# Altium project AltiumProject.PrjPcb
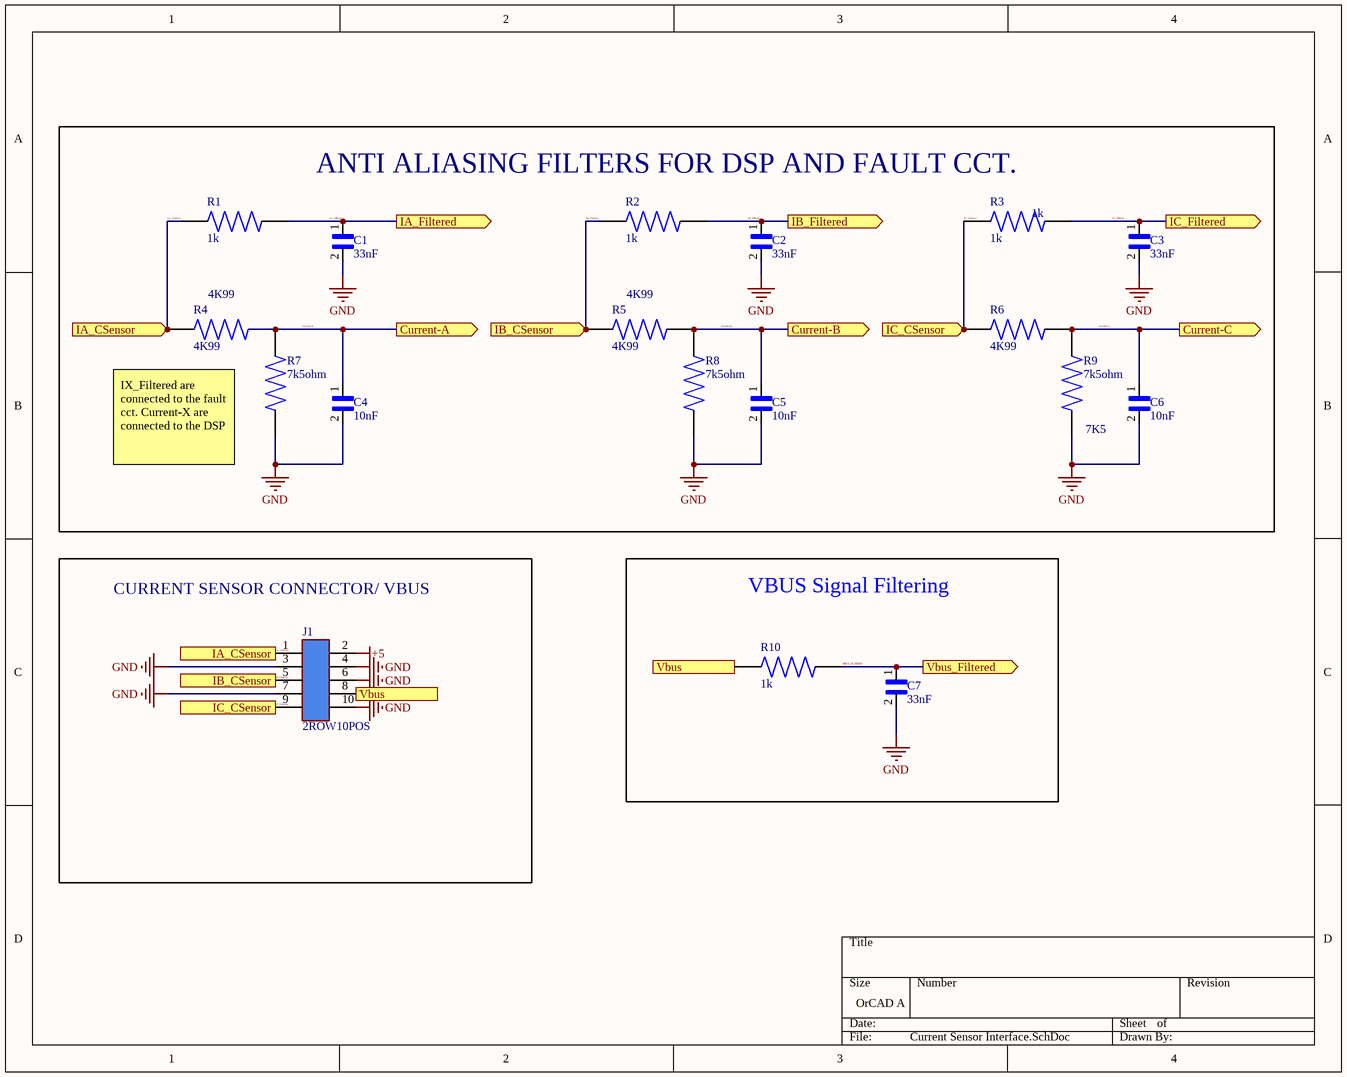
[diagram p0: Current Sensor Interface.SchDoc]
10 sheets, 249 parts. Net scope: flat (ports and power ports of the same name join across sheets).
Board files: Controller_PVC_v2.PcbDoc, Controller_4Layers.PcbDoc, Controller Board.PcbDoc, Control Board 4Layer.PcbDoc
Sheets:
  Current Sensor Interface.SchDoc
  FaultCircuit.SchDoc
  Launchpad.~(23).SchDoc
  PowerSupply.SchDoc
  CAN.SchDoc
  Voltage Sensor Interface.SchDoc
  Temp Sensor Interface.SchDoc
  Resolver.SchDoc
  Gate Driver Interface.SchDoc
  Block Diagram.SchDoc

## Sheet Current Sensor Interface.SchDoc
size OrCAD A

### Parts
C1  33nF  [CAP 0805(2012 metric)]
C2  33nF  [CAP 0805(2012 metric)]
C3  33nF  [CAP 0805(2012 metric)]
C4  10nF  [CAP 0805(2012 metric)]
C5  10nF  [CAP 0805(2012 metric)]
C6  10nF  [CAP 0805(2012 metric)]
C7  33nF  [CAP 0805(2012 metric)]
J1  2ROW10POS  [2ROW10POS]
R1  1k  [RES 0805(2012 metric)]
R2  1k  [RES 0805(2012 metric)]
R3  1k  [RES 0805(2012 metric)]
R4  4K99  [RES 0805(2012 metric)]
R5  4K99  [RES 0805(2012 metric)]
R6  4K99  [RES 0805(2012 metric)]
R7  7k5ohm  [RES 0805(2012 metric)]
R8  7k5ohm  [RES 0805(2012 metric)]
R9  7k5ohm  [RES 0805(2012 metric)]
R10  1k  [RES 0805(2012 metric)]

### Blocks framed on the sheet
ANTI ALIASING FILTERS FOR DSP AND FAULT CCT.: C1-C6 R1-R9
CURRENT SENSOR CONNECTOR/ VBUS: J1
VBUS Signal Filtering: C7 R10

### Ports
Current-A (out), Current-B (out), Current-C (out), IA_CSensor (in), IA_CSensor (out), IA_Filtered (out), IB_CSensor (in), IB_CSensor (out), IB_Filtered (out), IC_CSensor (in), IC_CSensor (out), IC_Filtered (out), Vbus (in), Vbus (out), Vbus_Filtered (out)

### Nets
+5: J1.2
GND: C1.2 C2.2 C3.2 C4.2 C5.2 C6.2 C7.2 J1.3 J1.4 J1.6 J1.7 J1.10 R7.1 R8.1 R9.1
Current-A: C4.1 R4.2 R7.2 ; port Current-A
Current-B: C5.1 R5.2 R8.2 ; port Current-B
Current-C: C6.1 R6.2 R9.2 ; port Current-C
IA_CSensor: J1.1 R1.1 R4.1 ; port IA_CSensor
IA_Filtered: C1.1 R1.2 ; port IA_Filtered
IB_CSensor: J1.5 R2.1 R5.1 ; port IB_CSensor
IB_Filtered: C2.1 R2.2 ; port IB_Filtered
IC_CSensor: J1.9 R3.1 R6.1 ; port IC_CSensor
IC_Filtered: C3.1 R3.2 ; port IC_Filtered
VBUS: J1.8 R10.1 ; port Vbus
VBUS_FILTERED: C7.1 R10.2 ; port Vbus_Filtered

### Notes on the sheet
- (near R3) 1k
- (near R4) 4K99
- (near R5) 4K99
- IX_Filtered are connected to the fault cct. Current-X are connected to the DSP
- (near R9) 7K5

### Library data of the parts
C1-C3 C7 = 33nF: 0.033µF ±10% 100V Ceramic Capacitor X7R 0805 (2012 Metric)
C4-C6 = 10nF: 10000pF ±10% 25V Ceramic Capacitor X7R 0805 (2012 Metric)
R1-R3 R10 = 1k: Resistor 0805 1k ohm 0.1W

## Sheet FaultCircuit.SchDoc
size B; DrawnBy: MYazici
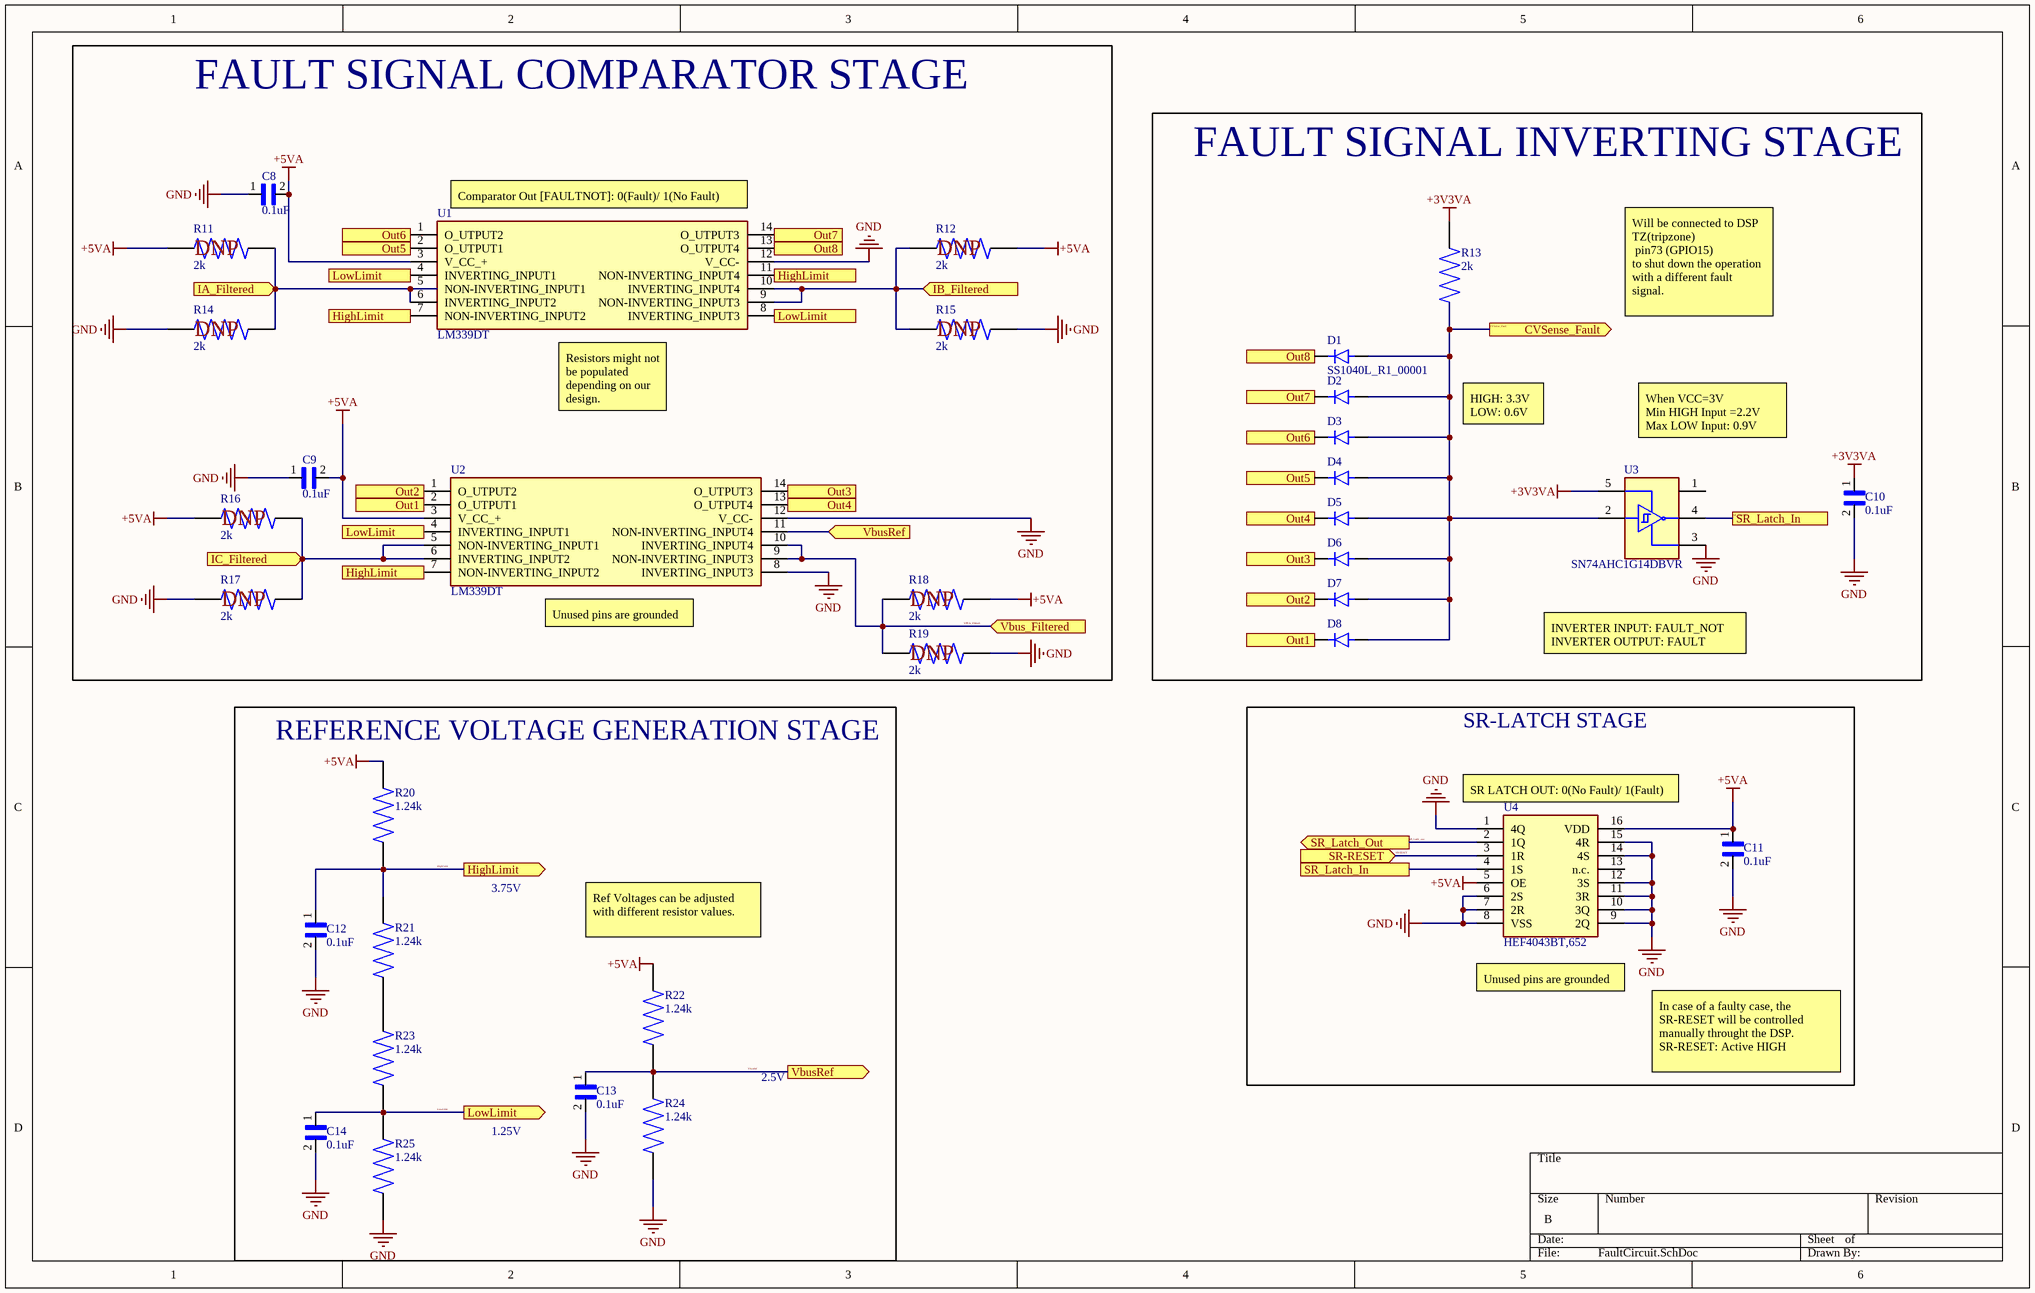
[diagram p1: FaultCircuit.SchDoc]

### Parts
C8  0.1uF  [CAP 0805(2012 metric)]
C9  0.1uF  [CAP 0805(2012 metric)]
C10  0.1uF  [CAP 0805(2012 metric)]
C11  0.1uF  [CAP 0805(2012 metric)]
C12  0.1uF  [CAP 0805(2012 metric)]
C13  0.1uF  [CAP 0805(2012 metric)]
C14  0.1uF  [CAP 0805(2012 metric)]
D1  SS1040L_R1_00001  [SOD123]
D2  SS1040L_R1_00001  [SOD123]  (value not drawn)
D3  SS1040L_R1_00001  [SOD123]  (value not drawn)
D4  SS1040L_R1_00001  [SOD123]  (value not drawn)
D5  SS1040L_R1_00001  [SOD123]  (value not drawn)
D6  SS1040L_R1_00001  [SOD123]  (value not drawn)
D7  SS1040L_R1_00001  [SOD123]  (value not drawn)
D8  SS1040L_R1_00001  [SOD123]  (value not drawn)
R11  2k  [RES 0805(2012 metric)]
R12  2k  [RES 0805(2012 metric)]
R13  2k  [RES 0805(2012 metric)]
R14  2k  [RES 0805(2012 metric)]
R15  2k  [RES 0805(2012 metric)]
R16  2k  [RES 0805(2012 metric)]
R17  2k  [RES 0805(2012 metric)]
R18  2k  [RES 0805(2012 metric)]
R19  2k  [RES 0805(2012 metric)]
R20  1.24k  [RES 0805(2012 metric)]
R21  1.24k  [RES 0805(2012 metric)]
R22  1.24k  [RES 0805(2012 metric)]
R23  1.24k  [RES 0805(2012 metric)]
R24  1.24k  [RES 0805(2012 metric)]
R25  1.24k  [RES 0805(2012 metric)]
U1  LM339DT  [SOIC127P600X175-14N]
U2  LM339DT  [SOIC127P600X175-14N]
U3  SN74AHC1G14DBVR  [SN74AHC1G14DBVR]
U4  HEF4043BT,652  [SOIC127P600X175-16N]

### Blocks framed on the sheet
FAULT SIGNAL COMPARATOR STAGE: C8 C9 R11 R12 R14-R19 U1 U2
FAULT SIGNAL INVERTING STAGE: C10 D1-D8 R13 U3
REFERENCE VOLTAGE GENERATION STAGE: C12-C14 R20-R25
SR-LATCH STAGE: C11 U4

### Ports
CVSense_Fault (out), HighLimit (in), HighLimit (out), IA_Filtered (in), IB_Filtered (in), IC_Filtered (in), LowLimit (in), LowLimit (out), Out1 (in), Out1 (out), Out2 (in), Out2 (out), Out3 (in), Out3 (out), Out4 (in), Out4 (out), Out5 (in), Out5 (out), Out6 (in), Out6 (out), Out7 (in), Out7 (out), Out8 (in), Out8 (out), SR-RESET (in), SR_Latch_In, SR_Latch_Out (out), Vbus_Filtered (in), VbusRef (in), VbusRef (out)

### Nets
+3V3VA: C10.1 R13.2 U3.5(VCC)
+5VA: C8.2 C9.2 C11.1 R11.1 R12.2 R16.1 R18.2 R20.2 R22.2 U1.3(V_CC_+) U2.3(V_CC_+) U4.5(OE) U4.16(VDD)
GND: C8.1 C9.1 C10.2 C11.2 C12.2 C13.2 C14.2 R14.1 R15.2 R17.1 R19.2 R24.1 R25.1 U1.12(V_CC-) U2.8(INVERTING_INPUT3) U2.12(V_CC-) U3.3(GND) U4.1(4Q) U4.6(2S) U4.7(2R) U4.8(VSS) U4.9(2Q) U4.10(3Q) U4.11(3R) U4.12(3S) U4.14(4S) U4.15(4R)
CVSense_Fault: D1.2(Anode) D2.2(Anode) D3.2(Anode) D4.2(Anode) D5.2(Anode) D6.2(Anode) D7.2(Anode) D8.2(Anode) R13.1 U3.2(A) ; port CVSense_Fault
HighLimit: C12.1 R20.1 R21.2 U1.7(NON-INVERTING_INPUT2) U1.11(NON-INVERTING_INPUT4) U2.7(NON-INVERTING_INPUT2) ; port HighLimit
IA_Filtered: R11.2 R14.2 U1.5(NON-INVERTING_INPUT1) U1.6(INVERTING_INPUT2) ; port IA_Filtered
IB_Filtered: R12.1 R15.1 U1.9(NON-INVERTING_INPUT3) U1.10(INVERTING_INPUT4) ; port IB_Filtered
IC_Filtered: R16.2 R17.2 U2.5(NON-INVERTING_INPUT1) U2.6(INVERTING_INPUT2) ; port IC_Filtered
LowLimit: C14.1 R23.1 R25.2 U1.4(INVERTING_INPUT1) U1.8(INVERTING_INPUT3) U2.4(INVERTING_INPUT1) ; port LowLimit
SR-RESET: U4.3(1R) ; port SR-RESET
SR_Latch_In: U3.4(Y) U4.4(1S) ; port SR_Latch_In
SR_Latch_out: U4.2(1Q) ; port SR_Latch_Out
VBUS_FILTERED: R18.1 R19.1 U2.9(NON-INVERTING_INPUT3) U2.10(INVERTING_INPUT4) ; port Vbus_Filtered
VbusRef: C13.1 R22.1 R24.2 U2.11(NON-INVERTING_INPUT4) ; port VbusRef
NetD1_1: D1.1(Cathode) U1.13(O_UTPUT4) ; port Out8
NetD2_1: D2.1(Cathode) U1.14(O_UTPUT3) ; port Out7
NetD3_1: D3.1(Cathode) U1.1(O_UTPUT2) ; port Out6
NetD4_1: D4.1(Cathode) U1.2(O_UTPUT1) ; port Out5
NetD5_1: D5.1(Cathode) U2.13(O_UTPUT4) ; port Out4
NetD6_1: D6.1(Cathode) U2.14(O_UTPUT3) ; port Out3
NetD7_1: D7.1(Cathode) U2.1(O_UTPUT2) ; port Out2
NetD8_1: D8.1(Cathode) U2.2(O_UTPUT1) ; port Out1
NetR21_1: R21.1 R23.2

Not connected (* = marked no-connect by the designer): U3 1(NC); U4 13(n.c.)

### Notes on the sheet
- (near U1) Comparator Out [FAULTNOT]: 0(Fault)/ 1(No Fault)
- (near R11) DNP
- (near R12) DNP
- (near R14) DNP
- (near R15) DNP
- Will be connected to DSP TZ(tripzone)
  pin73 (GPIO15)
  to shut down the operation with a different fault signal.
- (near U1) Resistors might not be populated depending on our design.
- HIGH: 3.3V LOW: 0.6V
- When VCC=3V
  Min HIGH Input =2.2V
  Max LOW Input: 0.9V
- (near R16) DNP
- (near R17) DNP
- (near U2) Unused pins are grounded
- (near R18) DNP
- (near R19) DNP
- INVERTER INPUT: FAULT_NOT
  INVERTER OUTPUT: FAULT
- (near U4) SR LATCH OUT: 0(No Fault)/ 1(Fault)
- 3.75V
- Ref Voltages can be adjusted with different resistor values.
- (near U4) Unused pins are grounded
- 2.5V
- In case of a faulty case, the SR-RESET will be controlled manually throught the DSP.
  SR-RESET: Active HIGH
- 1.25V

### Library data of the parts
C8-C14 = 0.1uF: 0.1µF ±10% 25V Ceramic Capacitor X7R 0805
R11-R19 = 2k 0.1W: 2 kOhms ±1% 0.1W, 1/10W Chip Resistor 0603 (1608 Metric) Moisture Resistant Thick Film
R20-R25 = 1.24k 0805
U1 U2 = LM339DT: Integrated Circuit; Manufacturer_Name: STMicroelectronics; Datasheet Link: http://www.st.com/st-web-ui/static/active/en/resource/technical/document/datasheet/CD00000460.pdf; Height: 1.75mm; Manufacturer_Part_Number: LM339DT; Mouser Part Number: 511-LM339DT; Mouser Price/Stock: https://www.mouser.co.uk/ProductDetail/STMicroelectronics/LM339DT?qs=8q6yV%252BexmWU1LP6UrPvZEQ%3D%3D; Arrow Part Number: LM339DT; Arrow Price/Stock: https://www.arrow.com/en/products/lm339dt/stmicroelectronics; Supplier 1: Avnet; Supplier Part Number 1: LM339DTBR2G
U3 = SN74AHC1G14DBVR: Inverter
U4 = HEF4043BT,652: Integrated Circuit; Manufacturer_Name: Nexperia; Datasheet Link: https://assets.nexperia.com/documents/data-sheet/HEF4043B.pdf; Height: 1.75mm; Manufacturer_Part_Number: HEF4043BT,652; Mouser Part Number: 771-HEF4043BT652; Mouser Price/Stock: https://www.mouser.com/Search/Refine.aspx?Keyword=771-HEF4043BT652; Arrow Part Number: HEF4043BT,652; Arrow Price/Stock: https://www.arrow.com/en/products/hef4043bt652/nexperia

## Sheet Launchpad.~(23).SchDoc
size C
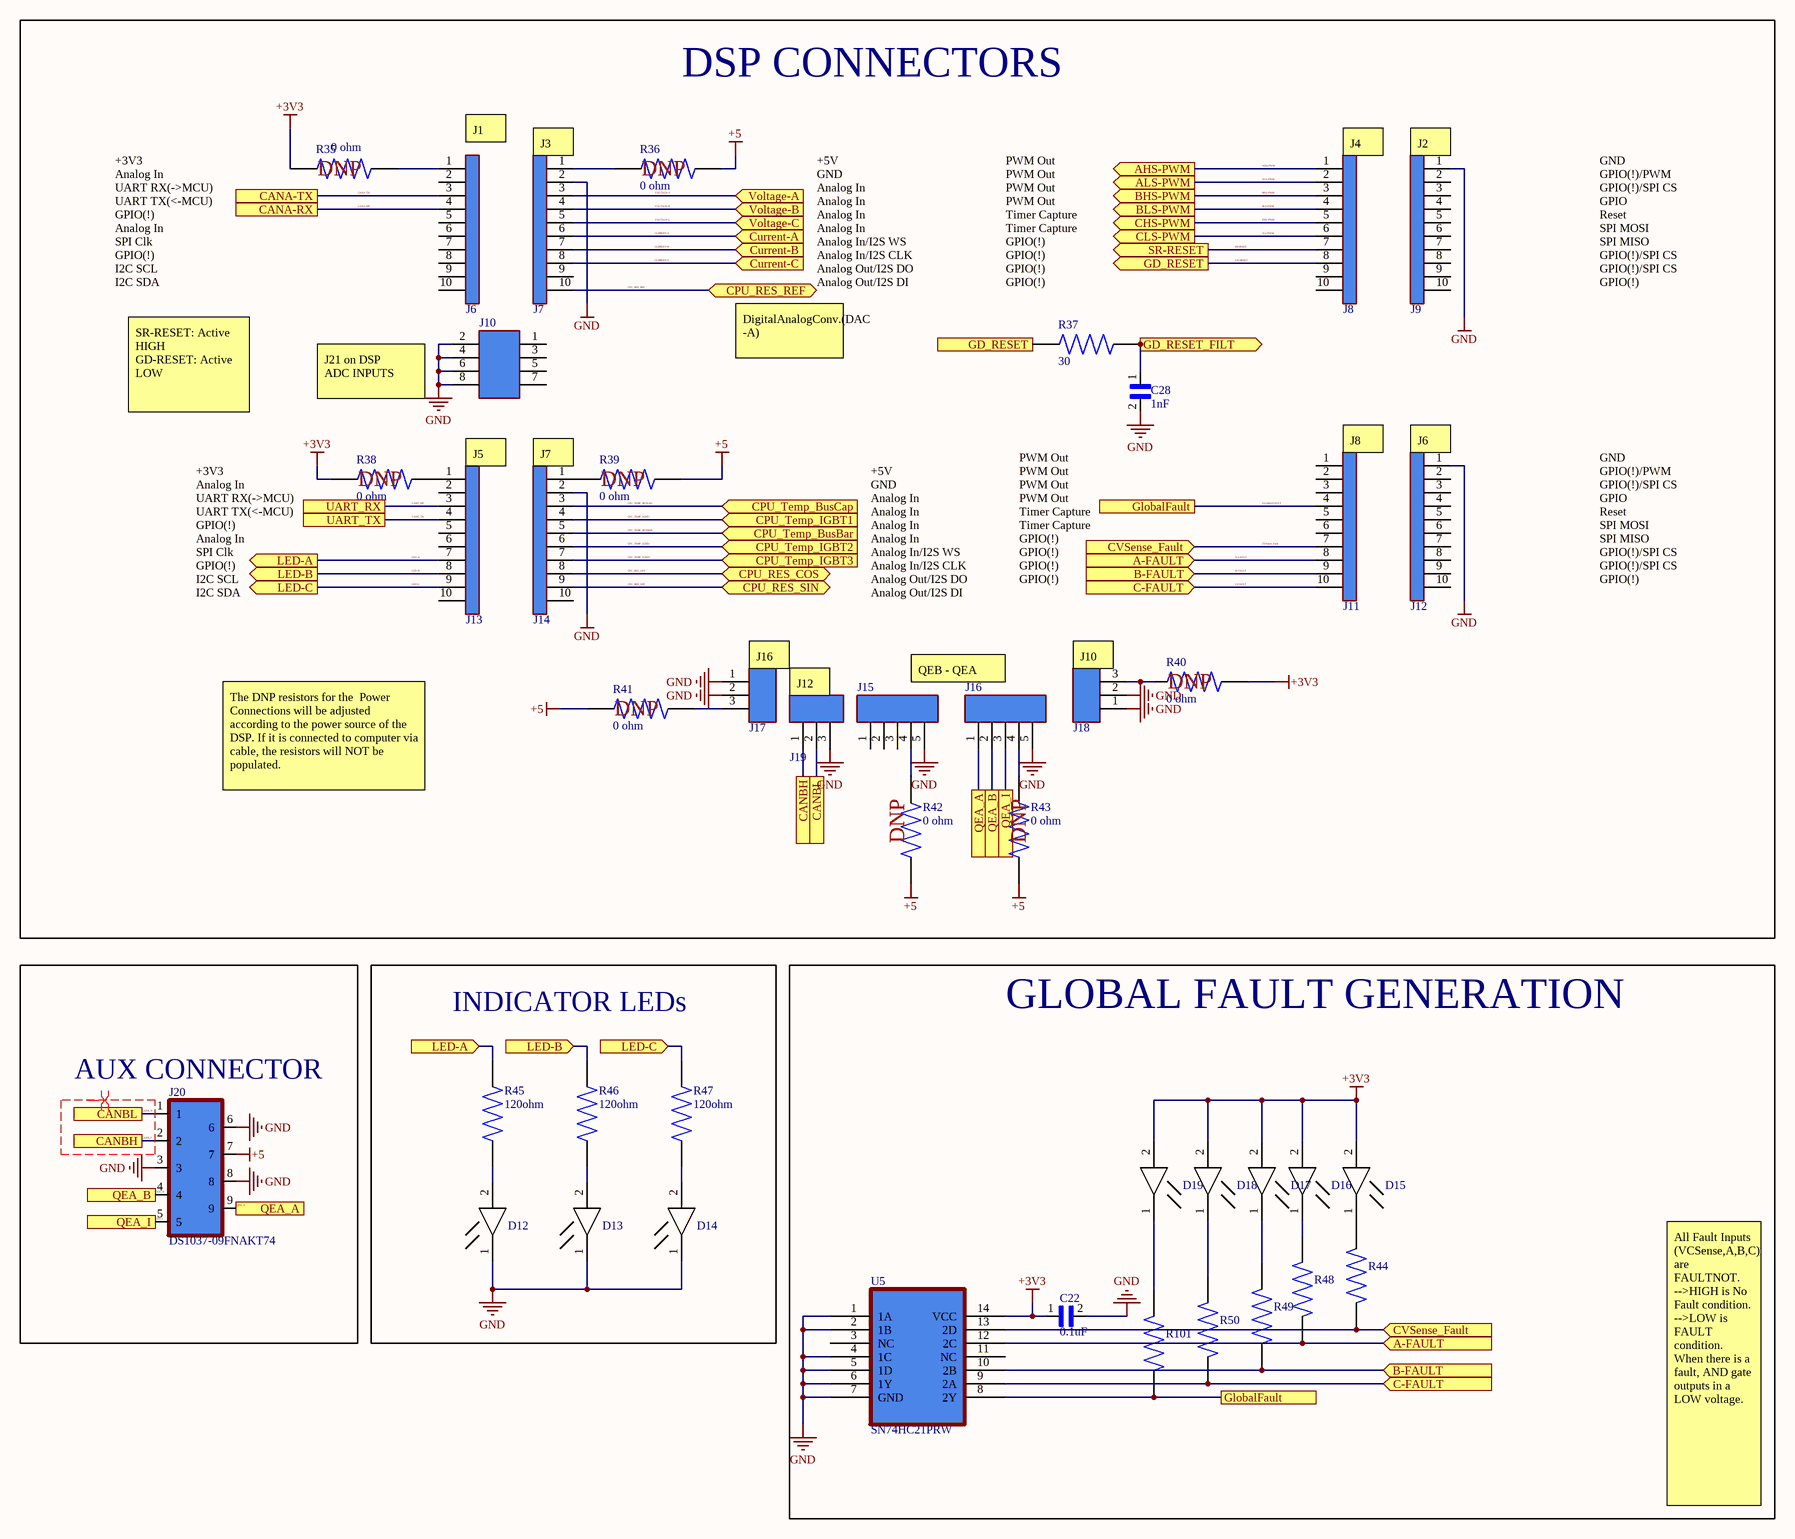
[diagram p2: Launchpad.~(23).SchDoc]

### Parts
(Parts that share a designator on the sheet are numbered #1, #2 ... from top to bottom, then left to right.)
C22  0.1uF  [CAP 0805(2012 metric)]
C28  1nF  [CAP 0805(2012 metric)]
D12  LED 17-21/Y2C-AN1P2/3T  [17-21/Y2C-AN1P2/3T]  (value not drawn)
D13  LED 17-21/Y2C-AN1P2/3T  [17-21/Y2C-AN1P2/3T]  (value not drawn)
D14  LED 17-21/Y2C-AN1P2/3T  [17-21/Y2C-AN1P2/3T]  (value not drawn)
D15  LED 17-21/Y2C-AN1P2/3T  [17-21/Y2C-AN1P2/3T]  (value not drawn)
D16  LED 17-21/Y2C-AN1P2/3T  [17-21/Y2C-AN1P2/3T]  (value not drawn)
D17  LED 17-21/Y2C-AN1P2/3T  [17-21/Y2C-AN1P2/3T]  (value not drawn)
D18  LED 17-21/Y2C-AN1P2/3T  [17-21/Y2C-AN1P2/3T]  (value not drawn)
D19  LED 17-21/Y2C-AN1P2/3T  [17-21/Y2C-AN1P2/3T]  (value not drawn)
J6  1ROW10POS  [1ROW10POS]  (value not drawn)
J7  1ROW10POS  [1ROW10POS]  (value not drawn)
J8  1ROW10POS  [1ROW10POS]  (value not drawn)
J9  1ROW10POS  [1ROW10POS]  (value not drawn)
J10  2ROW8POS  [2ROW8POS]  (value not drawn)
J11  1ROW10POS  [1ROW10POS]  (value not drawn)
J12  1ROW10POS  [1ROW10POS]  (value not drawn)
J13  1ROW10POS  [1ROW10POS]  (value not drawn)
J14  1ROW10POS  [1ROW10POS]  (value not drawn)
J15#1  1ROW5POS  [1ROW5POS]  (value not drawn)
J16  1ROW5POS  [1ROW5POS]  (value not drawn)
J17  1ROW3POS  [1ROW3POS]  (value not drawn)
J18  1ROW3POS  [1ROW3POS]  (value not drawn)
J19  1ROW3POS  [1ROW3POS]  (value not drawn)
J20  DS1037-09FNAKT74  [DSUB CONN 9 POS]
R35  0 ohm  [RES 0805(2012 metric)]
R36  0 ohm  [RES 0805(2012 metric)]
R37  30  [RES 0805(2012 metric)]
R38  0 ohm  [RES 0805(2012 metric)]
R39  0 ohm  [RES 0805(2012 metric)]
R40  0 ohm  [RES 0805(2012 metric)]
R41  0 ohm  [RES 0805(2012 metric)]
R42  0 ohm  [RES 0805(2012 metric)]
R43  0 ohm  [RES 0805(2012 metric)]
R44  1.24k  [RES 0805(2012 metric)]  (value not drawn)
R45  120ohm  [RES 0805(2012 metric)]
R46  120ohm  [RES 0805(2012 metric)]
R47  120ohm  [RES 0805(2012 metric)]
R48  1.24k  [RES 0805(2012 metric)]  (value not drawn)
R49  1.24k  [RES 0805(2012 metric)]  (value not drawn)
R50  1.24k  [RES 0805(2012 metric)]  (value not drawn)
R101  1.24k  [RES 0805(2012 metric)]  (value not drawn)
U5  SN74HC21PRW  [SN74HC21PWR]

### Blocks framed on the sheet
DSP CONNECTORS: C28 J6-J14 J15#1 J16-J19 R35-R43
AUX CONNECTOR: J20
INDICATOR LEDs: D12-D14 R45-R47
GLOBAL FAULT GENERATION: C22 D15-D19 R44 R48-R50 R101 U5

### Ports
A-FAULT (in), AHS-PWM (out), ALS-PWM (out), B-FAULT (in), BHS-PWM (out), BLS-PWM (out), C-FAULT (in), CANA-RX, CANA-TX, CANBH, CANBL, CHS-PWM (out), CLS-PWM (out), CPU_RES_COS (bidir), CPU_RES_REF (bidir), CPU_RES_SIN (bidir), CPU_Temp_BusBar (in), CPU_Temp_BusCap (in), CPU_Temp_IGBT1 (in), CPU_Temp_IGBT2 (in), CPU_Temp_IGBT3 (in), Current-A (in), Current-B (in), Current-C (in), CVSense_Fault (in), GD_RESET (in), GD_RESET (out), GD_RESET_FILT (out), GlobalFault, LED-A (in), LED-A (out), LED-B (in), LED-B (out), LED-C (in), LED-C (out), QEA_A, QEA_B, QEA_I, SR-RESET (out), UART_RX, UART_TX, Voltage-A (in), Voltage-B (in), Voltage-C (in)

### Nets
+3V3: C22.1 D15.2(Anode) D16.2(Anode) D17.2(Anode) D18.2(Anode) D19.2(Anode) R35.1 R38.1 R40.1 U5.14(VCC)
+5: J20.7 R36.2 R39.2 R41.1 R42.1 R43.1
GND: C22.2 C28.2 D12.1(Cathode) D13.1(Cathode) D14.1(Cathode) J7.2 J9.1 J10.2 J10.4 J10.6 J10.8 J12.1 J14.2 J15#1.5 J16.5 J17.1 J17.2 J18.1 J18.2 J19.3 J20.3 J20.6 J20.8 U5.1(1A) U5.2(1B) U5.4(1C) U5.5(1D) U5.6(1Y) U5.7(GND)
A-FAULT: J11.8 R48.1 U5.12(2C) ; port A-FAULT
AHS-PWM: J8.1 ; port AHS-PWM
ALS-PWM: J8.2 ; port ALS-PWM
B-FAULT: J11.9 R49.1 U5.10(2B) ; port B-FAULT
BHS-PWM: J8.3 ; port BHS-PWM
BLS-PWM: J8.4 ; port BLS-PWM
C-FAULT: J11.10 R50.1 U5.9(2A) ; port C-FAULT
CANA-RX: J6.4 ; port CANA-RX
CANA-TX: J6.3 ; port CANA-TX
CANB_N: J19.2 J20.1 ; port CANBL
CANB_P: J19.1 J20.2 ; port CANBH
CHS-PWM: J8.5 ; port CHS-PWM
CLS-PWM: J8.6 ; port CLS-PWM
CPU_RES_COS: J14.8 ; port CPU_RES_COS
CPU_RES_REF: J7.10 ; port CPU_RES_REF
CPU_RES_SIN: J14.9 ; port CPU_RES_SIN
CPU_TEMP_BUSBAR: J14.5 ; port CPU_Temp_BusBar
CPU_TEMP_BUSCAP: J14.3 ; port CPU_Temp_BusCap
CPU_TEMP_IGBT1: J14.4 ; port CPU_Temp_IGBT1
CPU_TEMP_IGBT2: J14.6 ; port CPU_Temp_IGBT2
CPU_TEMP_IGBT3: J14.7 ; port CPU_Temp_IGBT3
Current-A: J7.6 ; port Current-A
Current-B: J7.7 ; port Current-B
Current-C: J7.8 ; port Current-C
CVSense_Fault: J11.7 R44.1 U5.13(2D) ; port CVSense_Fault
GD-RESET: J8.8 R37.1 ; port GD_RESET
GD_RESET_FILT: C28.1 R37.2 ; port GD_RESET_FILT
GLOBALFAULT: J11.4 R101.1 U5.8(2Y) ; port GlobalFault
LED-A: J13.7 R45.2 ; port LED-A
LED-B: J13.8 R46.2 ; port LED-B
LED-C: J13.9 R47.2 ; port LED-C
QEA_A: J16.1 J20.9 ; port QEA_A
QEA_B: J16.2 J20.4 ; port QEA_B
QEA_I: J16.3 J20.5 ; port QEA_I
SR-RESET: J8.7 ; port SR-RESET
UART_RX: J13.3 ; port UART_RX
UART_TX: J13.4 ; port UART_TX
VOLTAGE-A: J7.3 ; port Voltage-A
VOLTAGE-B: J7.4 ; port Voltage-B
VOLTAGE-C: J7.5 ; port Voltage-C
NetD12_2: D12.2(Anode) R45.1
NetD13_2: D13.2(Anode) R46.1
NetD14_2: D14.2(Anode) R47.1
NetD15_1: D15.1(Cathode) R44.2
NetD16_1: D16.1(Cathode) R48.2
NetD17_1: D17.1(Cathode) R49.2
NetD18_1: D18.1(Cathode) R50.2
NetD19_1: D19.1(Cathode) R101.2
NetJ6_1: J6.1 R35.2
NetJ7_1: J7.1 R36.1
NetJ13_1: J13.1 R38.2
NetJ14_1: J14.1 R39.1
NetJ15#1_4: J15#1.4 R42.2
NetJ16_4: J16.4 R43.2
NetJ17_3: J17.3 R41.2
NetJ18_3: J18.3 R40.2

Not connected (* = marked no-connect by the designer): J6 2 5 6 7 8 9 10; J7 9; J8 9 10; J9 2 3 4 5 6 7 8 9 10; J10 1 3 5 7; J11 1 2 3 5 6; J12 2 3 4 5 6 7 8 9 10; J13 2 5 6 10; J14 10; J15#1 1 2 3; U5 3(NC) 11(NC)

### Layout directives
differential pair; differential pair class DIFF90: CANB_N, CANB_P

### Notes on the sheet
- +3V3
- Analog In
- (near R35) DNP
- (near J6) J1
- (near J7) J3
- (near R36) DNP
- +5V
- GND
- PWM Out
- (near J8) J4
- (near J9) J2
- GPIO(!)/PWM
- UART RX(->MCU)
- UART TX(<-MCU)
- GPIO(!)
- SPI Clk
- Analog In/I2S WS
- Timer Capture
- GPIO(!)/SPI CS
- GPIO
- Reset
- SPI MOSI
- SPI MISO
- I2C SCL
- I2C SDA
- Analog In/I2S CLK
- Analog Out/I2S DO
- Analog Out/I2S DI
- DigitalAnalogConv.(DAC -A)
- SR-RESET: Active HIGH
  GD-RESET: Active LOW
- J21 on DSP
  ADC INPUTS
- (near J11) J8
- (near J12) J6
- (near R38) DNP
- (near J13) J5
- (near J14) J7
- (near R39) DNP
- (near R41) DNP
- (near J17) J16
- J12
- QEB - QEA
- (near J18) J10
- (near R40) DNP
- The DNP resistors for the  Power Connections will be adjusted according to the power source of the DSP. If it is connected to computer via cable, the resistors will NOT be populated.
- (near R42) DNP
- (near R43) DNP
- All Fault Inputs (VCSense,A,B,C) are FAULTNOT. -->HIGH is No Fault condition.
  -->LOW is FAULT condition.
  When there is a fault, AND gate outputs in a LOW voltage.

### Library data of the parts
C22 = 0.1uF: as C8 on sheet FaultCircuit
C28 = 0.1uF 25V 0805: 0.1µF ±10% 25V Ceramic Capacitor X7R 0805 (2012Metric)
D12-D19 = LED
J20 = DSBU CONN 9 POS
R35-R43 = 0ohm 0805: 0 ohm 0805 res
R44 R48-R50 R101 = 1.24k 0805
R45-R47 = 120ohm 0805: 120 Ohms ±5% 0.1W, 1/10W Chip Resistor 0805 (2012 Metric) Moisture Resistant Thick Film

## Sheet PowerSupply.SchDoc
size A
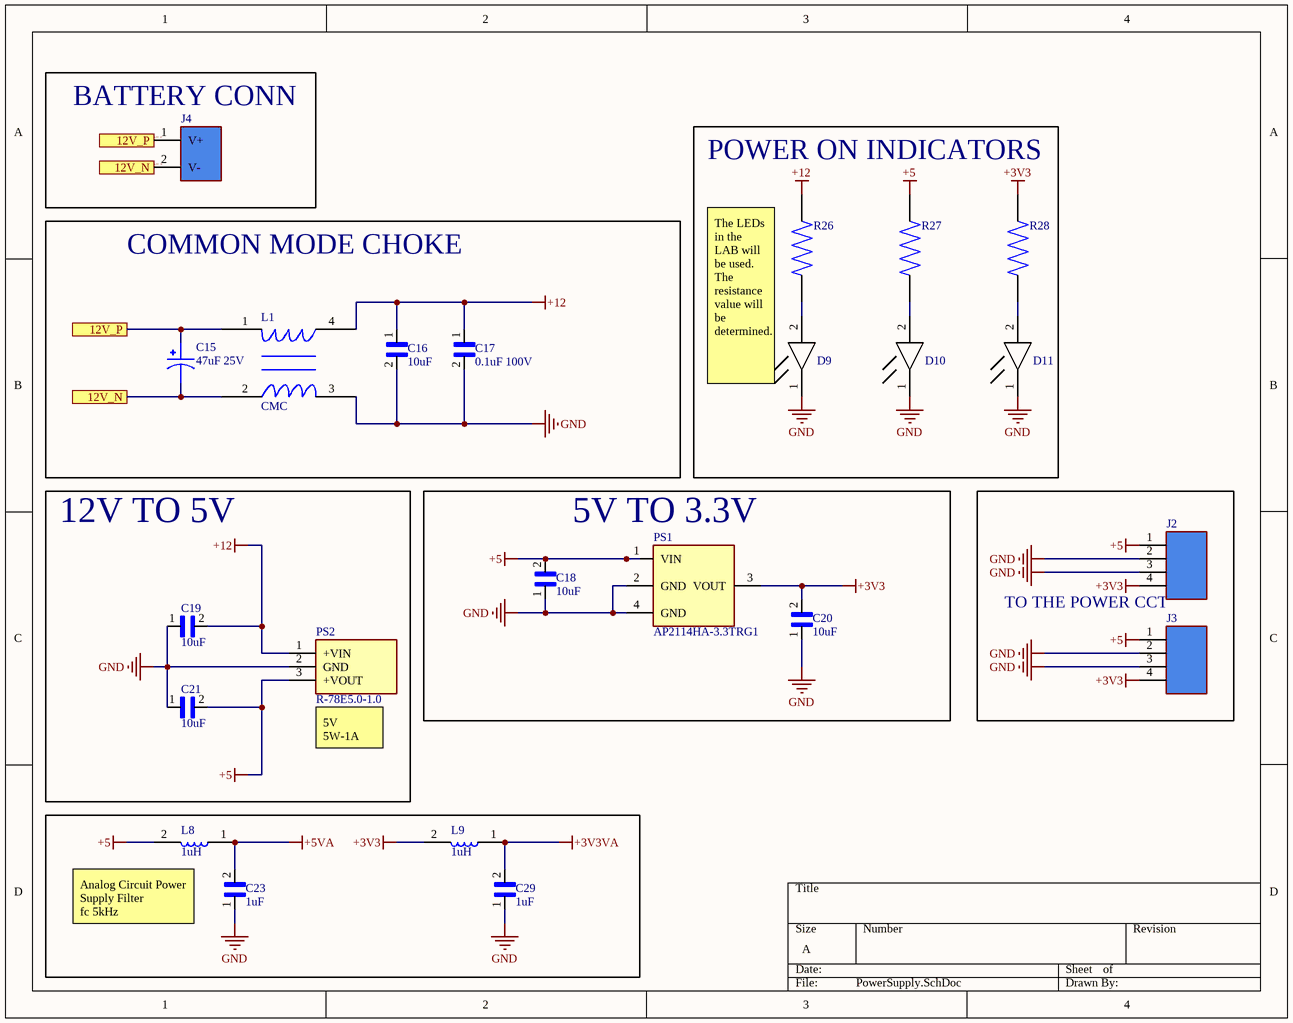
[diagram p3: PowerSupply.SchDoc]

### Parts
(Parts that share a designator on the sheet are numbered #1, #2 ... from top to bottom, then left to right.)
C15  47uF 25V  [EEE-HC1E470XP]
C16  10uF  [CAP 0805(2012 metric)]
C17  0.1uF 100V  [CAP 0805(2012 metric)]
C18  10uF  [CAP 0805(2012 metric)]
C19  10uF  [CAP 0805(2012 metric)]
C20  10uF  [CAP 0805(2012 metric)]
C21  10uF  [CAP 0805(2012 metric)]
C23  1uF  [CAP 0805(2012 metric)]
C29  1uF  [CAP 0805(2012 metric)]
D9  LED 17-21/Y2C-AN1P2/3T  [17-21/Y2C-AN1P2/3T]  (value not drawn)
D10  LED 17-21/Y2C-AN1P2/3T  [17-21/Y2C-AN1P2/3T]  (value not drawn)
D11  LED 17-21/Y2C-AN1P2/3T  [17-21/Y2C-AN1P2/3T]  (value not drawn)
J2  4POS1ROW  [4POS 1 ROW]  (value not drawn)
J3  4POS1ROW  [4POS 1 ROW]  (value not drawn)
J4  2 POS CONN  [2 POS CONN]  (value not drawn)
L1  CMC  [ACM7060-701-2PL-TL01]
L8  1uH  [IND 0805]
L9  1uH  [IND 0805]
PS1  AP2114HA-3.3TRG1  [SOT230P700X180-4N]
PS2  R-78E5.0-1.0  [R78E5010]
R26#1  1.24k  [RES 0805(2012 metric)]  (value not drawn)
R27#1  1.24k  [RES 0805(2012 metric)]  (value not drawn)
R28#1  1.24k  [RES 0805(2012 metric)]  (value not drawn)

### Blocks framed on the sheet
BATTERY CONN: J4
POWER ON INDICATORS: D9-D11 R26#1 R27#1 R28#1
COMMON MODE CHOKE: C15-C17 L1
12V TO 5V: C19 C21 PS2
5V TO 3.3V: C18 C20 PS1
TO THE POWER CCT: J2 J3

### Ports
12V_N, 12V_P

### Nets
+3V3: C20.2 J2.4 J3.4 L9.2 PS1.3(VOUT) R28#1.2
+3V3VA: C29.2 L9.1
+5: C18.2 C21.2 J2.1 J3.1 L8.2 PS1.1(VIN) PS2.3(+VOUT) R27#1.2
+5VA: C23.2 L8.1
+12: C16.1 C17.1 C19.2 L1.4 PS2.1(+VIN) R26#1.2
GND: C16.2 C17.2 C18.1 C19.1 C20.1 C21.1 C23.1 C29.1 D9.1(Cathode) D10.1(Cathode) D11.1(Cathode) J2.2 J2.3 J3.2 J3.3 L1.3 PS1.2(GND) PS1.4(GND) PS2.2(GND)
12V_N: C15.2 J4.2(V-) L1.2 ; port 12V_N
12V_P: C15.1 J4.1(V+) L1.1 ; port 12V_P
NetD9_2: D9.2(Anode) R26#1.1
NetD10_2: D10.2(Anode) R27#1.1
NetD11_2: D11.2(Anode) R28#1.1

### Notes on the sheet
- The LEDs in the LAB will be used.
  The resistance value will be determined.
- (near PS2) 5V
  5W-1A
- Analog Circuit Power Supply Filter
  fc 5kHz

### Library data of the parts
C15 = EEE-HC1E470XP
C16 C18-C21 C23 C29 = 10uF 25 VDC: 10uF %10 tolerance 25VDC 0805
D9-D11 = LED
L1 = ACM7060
L8 L9 = 1uH 0805: 1µH Shielded Multilayer Inductor 1.15A 60mOhm 0805 (2012 Metric)
PS2 = R-78E5.0-1.0: Power Supply; Manufacturer_Name: RECOM Power; Datasheet Link: http://www.recom-power.com/pdf/Innoline/R-78Exx-1.0.pdf; Height: 10.4mm; Manufacturer_Part_Number: R-78E5.0-1.0; Mouser Part Number: 919-R-78E5.0-1.0; Mouser Price/Stock: https://www.mouser.co.uk/ProductDetail/RECOM-Power/R-78E50-10/?qs=T0XSgvH75d4EsZCU9I5HVA%3D%3D; Arrow Part Number: R-78E5.0-1.0; Arrow Price/Stock: https://www.arrow.com/en/products/r-78e5.0-1.0/recom-power
R26#1 R27#1 R28#1 = 1.24k 0805

## Sheet CAN.SchDoc
size A
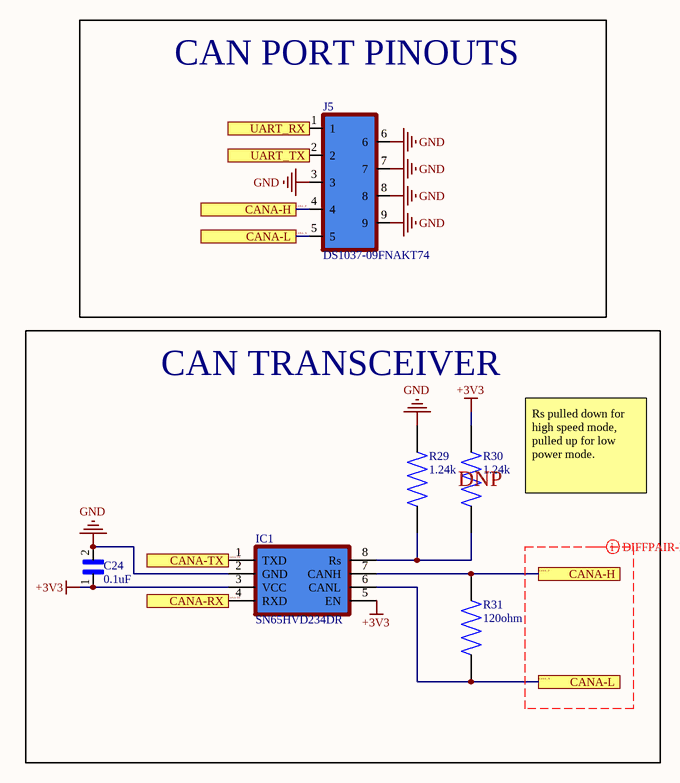
[diagram p4: CAN.SchDoc]

### Parts
C24  0.1uF  [CAP 0805(2012 metric)]
IC1  SN65HVD234DR  [SN65HVD234DR]
J5  DS1037-09FNAKT74  [DSUB CONN 9 POS]
R29  1.24k  [RES 0805(2012 metric)]
R30  1.24k  [RES 0805(2012 metric)]
R31  120ohm  [RES 0805(2012 metric)]

### Blocks framed on the sheet
CAN PORT PINOUTS: J5
CAN TRANSCEIVER: C24 IC1 R29-R31

### Ports
CANA-H, CANA-L, CANA-RX, CANA-TX, UART_RX, UART_TX

### Nets
+3V3: C24.1 IC1.3(VCC) IC1.5(EN) R30.2
GND: C24.2 IC1.2(GND) J5.3 J5.6 J5.7 J5.8 J5.9 R29.2
CANA-RX: IC1.4(RXD) ; port CANA-RX
CANA-TX: IC1.1(TXD) ; port CANA-TX
CANA_N: IC1.6(CANL) J5.5 R31.1 ; port CANA-L
CANA_P: IC1.7(CANH) J5.4 R31.2 ; port CANA-H
UART_RX: J5.1 ; port UART_RX
UART_TX: J5.2 ; port UART_TX
NetIC1_8: IC1.8(Rs) R29.1 R30.1

### Layout directives
differential pair; differential pair class DIFF90: CANA_N, CANA_P

### Notes on the sheet
- (near R30) DNP
- Rs pulled down for high speed mode, pulled up for low power mode.

### Library data of the parts
C24 = 0.1uF 25V 0805: as C28 on sheet Launchpad.~(23)
J5 = DSBU CONN 9 POS
R29 R30 = 1.24k 0805
R31 = 120ohm 0805: as R45 on sheet Launchpad.~(23)

## Sheet Voltage Sensor Interface.SchDoc
size A
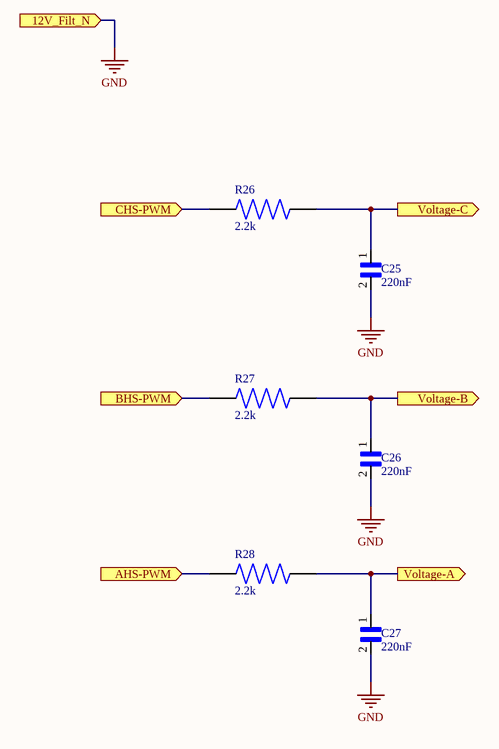
[diagram p5: Voltage Sensor Interface.SchDoc]

### Parts
(Parts that share a designator on the sheet are numbered #1, #2 ... from top to bottom, then left to right.)
C25  220nF  [CAP 0805(2012 metric)]
C26  220nF  [CAP 0805(2012 metric)]
C27  220nF  [CAP 0805(2012 metric)]
R26#2  2.2k  [RES 0805(2012 metric)]
R27#2  2.2k  [RES 0805(2012 metric)]
R28#2  2.2k  [RES 0805(2012 metric)]

### Ports
12V_Filt_N (in), AHS-PWM (in), BHS-PWM (in), CHS-PWM (in), Voltage-A (out), Voltage-B (out), Voltage-C (out)

### Nets
GND: C25.2 C26.2 C27.2 ; port 12V_Filt_N
AHS-PWM: R28#2.1 ; port AHS-PWM
BHS-PWM: R27#2.1 ; port BHS-PWM
CHS-PWM: R26#2.1 ; port CHS-PWM
VOLTAGE-A: C27.1 R28#2.2 ; port Voltage-A
VOLTAGE-B: C26.1 R27#2.2 ; port Voltage-B
VOLTAGE-C: C25.1 R26#2.2 ; port Voltage-C

### Library data of the parts
C25-C27 = 220nF 0805: 220nF 0805 50VDC
R26#2 R27#2 R28#2 = 2.2k 0805

## Sheet Temp Sensor Interface.SchDoc
size A
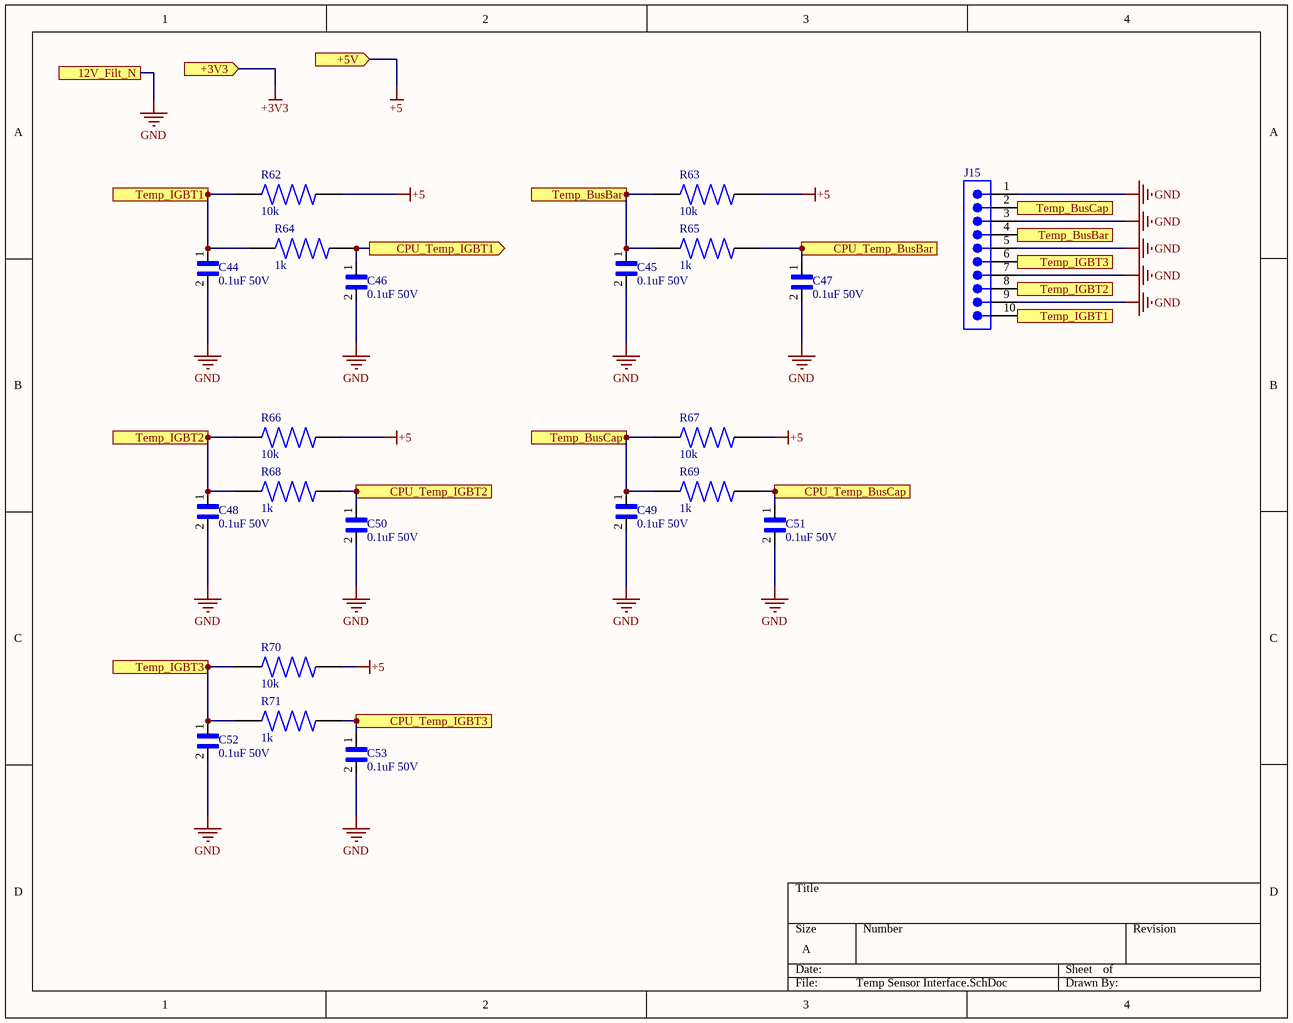
[diagram p6: Temp Sensor Interface.SchDoc]

### Parts
(Parts that share a designator on the sheet are numbered #1, #2 ... from top to bottom, then left to right.)
C44#1  0.1uF 50V  [CAP 0805(2012 metric)]
C45#1  0.1uF 50V  [CAP 0805(2012 metric)]
C46#1  0.1uF 50V  [CAP 0805(2012 metric)]
C47#1  0.1uF 50V  [CAP 0805(2012 metric)]
C48#1  0.1uF 50V  [CAP 0805(2012 metric)]
C49#1  0.1uF 50V  [CAP 0805(2012 metric)]
C50#1  0.1uF 50V  [CAP 0805(2012 metric)]
C51#1  0.1uF 50V  [CAP 0805(2012 metric)]
C52#1  0.1uF 50V  [CAP 0805(2012 metric)]
C53#1  0.1uF 50V  [CAP 0805(2012 metric)]
J15#2  FH2543-10GT10  [PCBComponent_1]  (value not drawn)
R62#1  10k  [RES 0805(2012 metric)]
R63#1  10k  [RES 0805(2012 metric)]
R64#1  1k  [RES 0805(2012 metric)]
R65#1  1k  [RES 0805(2012 metric)]
R66#1  10k  [RES 0805(2012 metric)]
R67#1  10k  [RES 0805(2012 metric)]
R68#1  1k  [RES 0805(2012 metric)]
R69#1  1k  [RES 0805(2012 metric)]
R70#1  10k  [RES 0805(2012 metric)]
R71#1  1k  [RES 0805(2012 metric)]

### Ports
12V_Filt_N, +3V3 (in), +5V (in), CPU_Temp_BusBar (out), CPU_Temp_BusCap (out), CPU_Temp_IGBT1 (out), CPU_Temp_IGBT2 (out), CPU_Temp_IGBT3 (out), Temp_BusBar (in), Temp_BusBar (out), Temp_BusCap (in), Temp_BusCap (out), Temp_IGBT1 (in), Temp_IGBT1 (out), Temp_IGBT2 (in), Temp_IGBT2 (out), Temp_IGBT3 (in), Temp_IGBT3 (out)

### Nets
+5: R62#1.2 R63#1.2 R66#1.2 R67#1.2 R70#1.2 ; port +5V
GND: C44#1.2 C45#1.2 C46#1.2 C47#1.2 C48#1.2 C49#1.2 C50#1.2 C51#1.2 C52#1.2 C53#1.2 J15#2.1 J15#2.3 J15#2.5 J15#2.7 J15#2.9 ; port 12V_Filt_N
CPU_TEMP_BUSBAR: C47#1.1 R65#1.2 ; port CPU_Temp_BusBar
CPU_TEMP_BUSCAP: C51#1.1 R69#1.2 ; port CPU_Temp_BusCap
CPU_TEMP_IGBT1: C46#1.1 R64#1.2 ; port CPU_Temp_IGBT1
CPU_TEMP_IGBT2: C50#1.1 R68#1.2 ; port CPU_Temp_IGBT2
CPU_TEMP_IGBT3: C53#1.1 R71#1.2 ; port CPU_Temp_IGBT3
NetC44#1_1: C44#1.1 J15#2.10 R62#1.1 R64#1.1 ; port Temp_IGBT1
NetC45#1_1: C45#1.1 J15#2.4 R63#1.1 R65#1.1 ; port Temp_BusBar
NetC48#1_1: C48#1.1 J15#2.8 R66#1.1 R68#1.1 ; port Temp_IGBT2
NetC49#1_1: C49#1.1 J15#2.2 R67#1.1 R69#1.1 ; port Temp_BusCap
NetC52#1_1: C52#1.1 J15#2.6 R70#1.1 R71#1.1 ; port Temp_IGBT3

### Library data of the parts
C44#1 C45#1 C46#1 C47#1 C48#1 C49#1 C50#1 C51#1 C52#1 C53#1 = 0.1uF 50V: 0.1uF 50VDC 0805
J15#2 = 1009002200006: Connector,Pin Socket,Straight,Female,1x10Pin,2.54MM pitch,8.5,3.2,Gold Flash 1u,black,DIP; Manufacturer: MTCONN; Value: 2.54mm 1x10; Embest PN: 1009002200006; Part Type: Pin Socket; Manufacturer Part Number: FH2543-10GT10
R62#1 R63#1 R66#1 R67#1 R70#1 = 10k 0.1W 0805
R64#1 R65#1 R68#1 R69#1 R71#1 = 1k: Resistor 0805 1k ohm 0.1W

## Sheet Resolver.SchDoc
size C
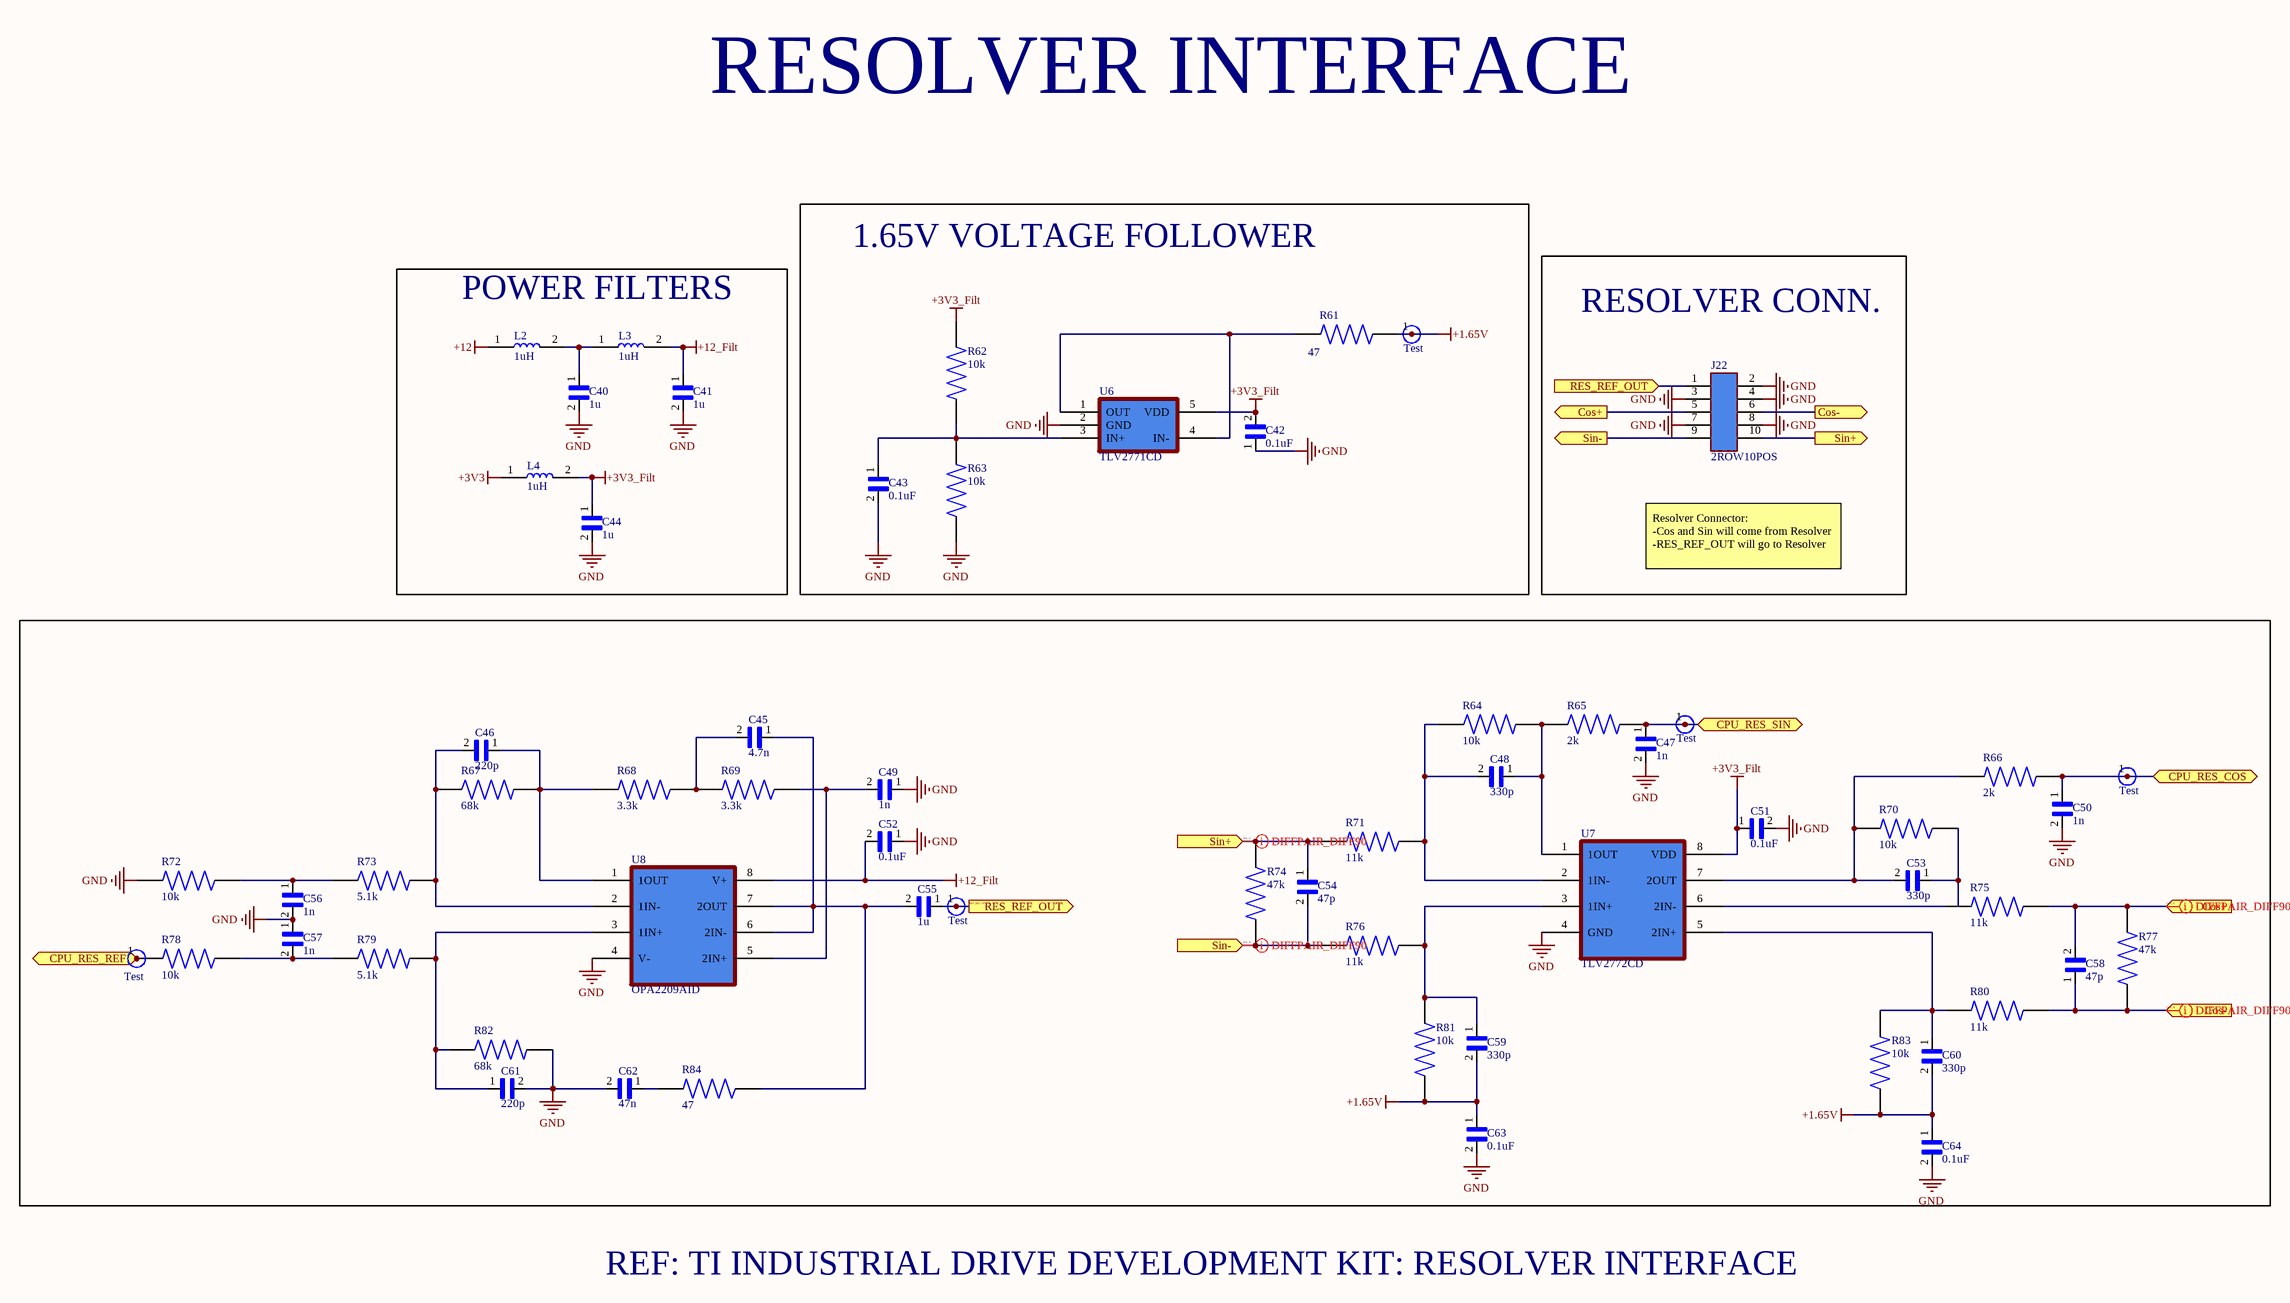
[diagram p7: Resolver.SchDoc]

### Parts
(Parts that share a designator on the sheet are numbered #1, #2 ... from top to bottom, then left to right.)
5  Test  [TestPoint]
6  Test  [TestPoint]
7  Test  [TestPoint]
8  Test  [TestPoint]
9  Test  [TestPoint]
C40  1u  [CAP 0805(2012 metric)]
C41  1u  [CAP 0805(2012 metric)]
C42  0.1uF  [CAP 0805(2012 metric)]
C43  0.1uF  [CAP 0805(2012 metric)]
C44#2  1u  [CAP 0805(2012 metric)]
C45#2  4.7n  [CAP 0805(2012 metric)]
C46#2  220p  [CAP 0805(2012 metric)]
C47#2  1n  [CAP 0805(2012 metric)]
C48#2  330p  [CAP 0805(2012 metric)]
C49#2  1n  [CAP 0805(2012 metric)]
C50#2  1n  [CAP 0805(2012 metric)]
C51#2  0.1uF  [CAP 0805(2012 metric)]
C52#2  0.1uF  [CAP 0805(2012 metric)]
C53#2  330p  [CAP 0805(2012 metric)]
C54  47p  [CAP 0805(2012 metric)]
C55  1u  [CAP 0805(2012 metric)]
C56  1n  [CAP 0805(2012 metric)]
C57  1n  [CAP 0805(2012 metric)]
C58  47p  [CAP 0805(2012 metric)]
C59  330p  [CAP 0805(2012 metric)]
C60  330p  [CAP 0805(2012 metric)]
C61  220p  [CAP 0805(2012 metric)]
C62  47n  [CAP 0805(2012 metric)]
C63  0.1uF  [CAP 0805(2012 metric)]
C64  0.1uF  [CAP 0805(2012 metric)]
J22  2ROW10POS  [2ROW10POS]
L2  1uH  [IND 0805]
L3  1uH  [IND 0805]
L4  1uH  [IND 0805]
R61  47  [RES 0805(2012 metric)]
R62#2  10k  [RES 0805(2012 metric)]
R63#2  10k  [RES 0805(2012 metric)]
R64#2  10k  [RES 0805(2012 metric)]
R65#2  2k  [RES 0805(2012 metric)]
R66#2  2k  [RES 0805(2012 metric)]
R67#2  68k  [RES 0805(2012 metric)]
R68#2  3.3k  [RES 0805(2012 metric)]
R69#2  3.3k  [RES 0805(2012 metric)]
R70#2  10k  [RES 0805(2012 metric)]
R71#2  11k  [RES 0805(2012 metric)]
R72  10k  [RES 0805(2012 metric)]
R73  5.1k  [RES 0805(2012 metric)]
R74  47k  [RES 0805(2012 metric)]
R75  11k  [RES 0805(2012 metric)]
R76  11k  [RES 0805(2012 metric)]
R77  47k  [RES 0805(2012 metric)]
R78  10k  [RES 0805(2012 metric)]
R79  5.1k  [RES 0805(2012 metric)]
R80  11k  [RES 0805(2012 metric)]
R81  10k  [RES 0805(2012 metric)]
R82  68k  [RES 0805(2012 metric)]
R83  10k  [RES 0805(2012 metric)]
R84  47  [RES 0805(2012 metric)]
U6  TLV2771CD  [TLV2771CD]
U7  TLV2772CD  [TLV2772CD]
U8  OPA2209AID  [OPA2209AID]

### Blocks framed on the sheet
1.65V VOLTAGE FOLLOWER: 5 C42 C43 R61 R62#2 R63#2 U6
POWER FILTERS: C40 C41 C44#2 L2-L4
RESOLVER CONN.: J22

### Ports
Cos+ (in), Cos+ (out), Cos- (in), Cos- (out), CPU_RES_COS (bidir), CPU_RES_REF (bidir), CPU_RES_SIN (bidir), RES_REF_OUT (in), RES_REF_OUT (out), Sin+ (in), Sin+ (out), Sin- (in), Sin- (out)

### Nets
+1.65V: 5.1 C59.2 C60.2 C63.1 C64.1 R61.2 R81.1 R83.1
+3V3: L4.1
+3V3_Filt: C42.2 C44#2.1 C51#2.1 L4.2 R62#2.2 U6.5(VDD) U7.8(VDD)
+12: L2.1
+12_Filt: C41.1 C52#2.2 L3.2 U8.8(V+)
GND: C40.2 C41.2 C42.1 C43.2 C44#2.2 C47#2.2 C49#2.1 C50#2.2 C51#2.2 C52#2.1 C56.2 C57.1 C61.2 C62.2 C63.2 C64.2 J22.2 J22.3 J22.4 J22.7 J22.8 R63#2.1 R72.1 R82.1 U6.2(GND) U7.4(GND) U8.4(V-)
COS_N: C58.1 J22.6 R77.2 R80.2 ; port Cos-
COS_P: C58.2 J22.5 R75.2 R77.1 ; port Cos+
CPU_RES_COS: 7.1 C50#2.1 R66#2.2 ; port CPU_RES_COS
CPU_RES_REF: 9.1 R78.1 ; port CPU_RES_REF
CPU_RES_SIN: 6.1 C47#2.1 R65#2.2 ; port CPU_RES_SIN
RES_REF_OUT: 8.1 C55.1 J22.1 ; port RES_REF_OUT
SIN_N: C54.2 J22.9 R74.1 R76.1 ; port Sin-
SIN_P: C54.1 J22.10 R71#2.1 R74.2 ; port Sin+
NetC40_1: C40.1 L2.2 L3.1
NetC43_1: C43.1 R62#2.1 R63#2.2 U6.3(IN+)
NetC45#2_1: C45#2.1 C55.2 R84.2 U8.6(2IN-) U8.7(2OUT)
NetC45#2_2: C45#2.2 R68#2.2 R69#2.1
NetC46#2_1: C46#2.1 R67#2.2 R68#2.1 U8.1(1OUT)
NetC46#2_2: C46#2.2 R67#2.1 R73.2 U8.2(1IN-)
NetC48#2_1: C48#2.1 R64#2.2 R65#2.1 U7.1(1OUT)
NetC48#2_2: C48#2.2 R64#2.1 R71#2.2 U7.2(1IN-)
NetC49#2_2: C49#2.2 R69#2.2 U8.5(2IN+)
NetC53#2_1: C53#2.1 R70#2.2
NetC53#2_2: C53#2.2 R66#2.1 R70#2.1 U7.7(2OUT)
NetC56_1: C56.1 R72.2 R73.1
NetC57_2: C57.2 R78.2 R79.1
NetC59_1: C59.1 R76.2 R81.2 U7.3(1IN+)
NetC60_1: C60.1 R80.1 R83.2 U7.5(2IN+)
NetC61_1: C61.1 R79.2 R82.2 U8.3(1IN+)
NetC62_1: C62.1 R84.1
NetR61_1: R61.1 U6.1(OUT) U6.4(IN-)
NetR75_1: R75.1 U7.6(2IN-)

### Layout directives
differential pair; differential pair class DIFF90: COS_N, COS_P, SIN_N, SIN_P

### Notes on the sheet
- RESOLVER INTERFACE
- Resolver Connector:
  -Cos and Sin will come from Resolver
  -RES_REF_OUT will go to Resolver
- REF: TI INDUSTRIAL DRIVE DEVELOPMENT KIT: RESOLVER INTERFACE

### Library data of the parts
5-9 = TestPoint
C40 C41 C44#2 C55 = 1u 0805
C42 C43 C51#2 C63 C64 = 0.1uF: as C8 on sheet FaultCircuit
C45#2 = 4.7n 0805
C46#2 C61 = 220p 0805
C47#2 C49#2 C50#2 C56 C57 = 1n 0805
C48#2 C53#2 C59 C60 = 330p 0805
C52#2 = 0.1uF 25V 0805: as C28 on sheet Launchpad.~(23)
C54 C58 = 47p 0805
C62 = 47n 0805
L2-L4 = 1uH 0805: as L8 on sheet PowerSupply
R61 R84 = 100ohm 0.1W: 100 Ohms ±1% 0.1W, 1/10W Chip Resistor 0805(2012 Metric) Moisture Resistant Thick Film
R62#2 R63#2 R64#2 R70#2 R72 R78 R81 R83 = 10k 0.1W 0805
R65#2 R66#2 = 2k 0805
R67#2 R82 = 68k 0805
R68#2 R69#2 = 3.3k 0805
R71#2 R75 R76 R80 = 11k 0805
R73 R79 = 5.1k 0805
R74 R77 = 47k 0805
U6 = TLV2771CD: TLV2771IDBVR
U7 = TLV2772CD: tlv2772cdR

## Sheet Gate Driver Interface.SchDoc
size B
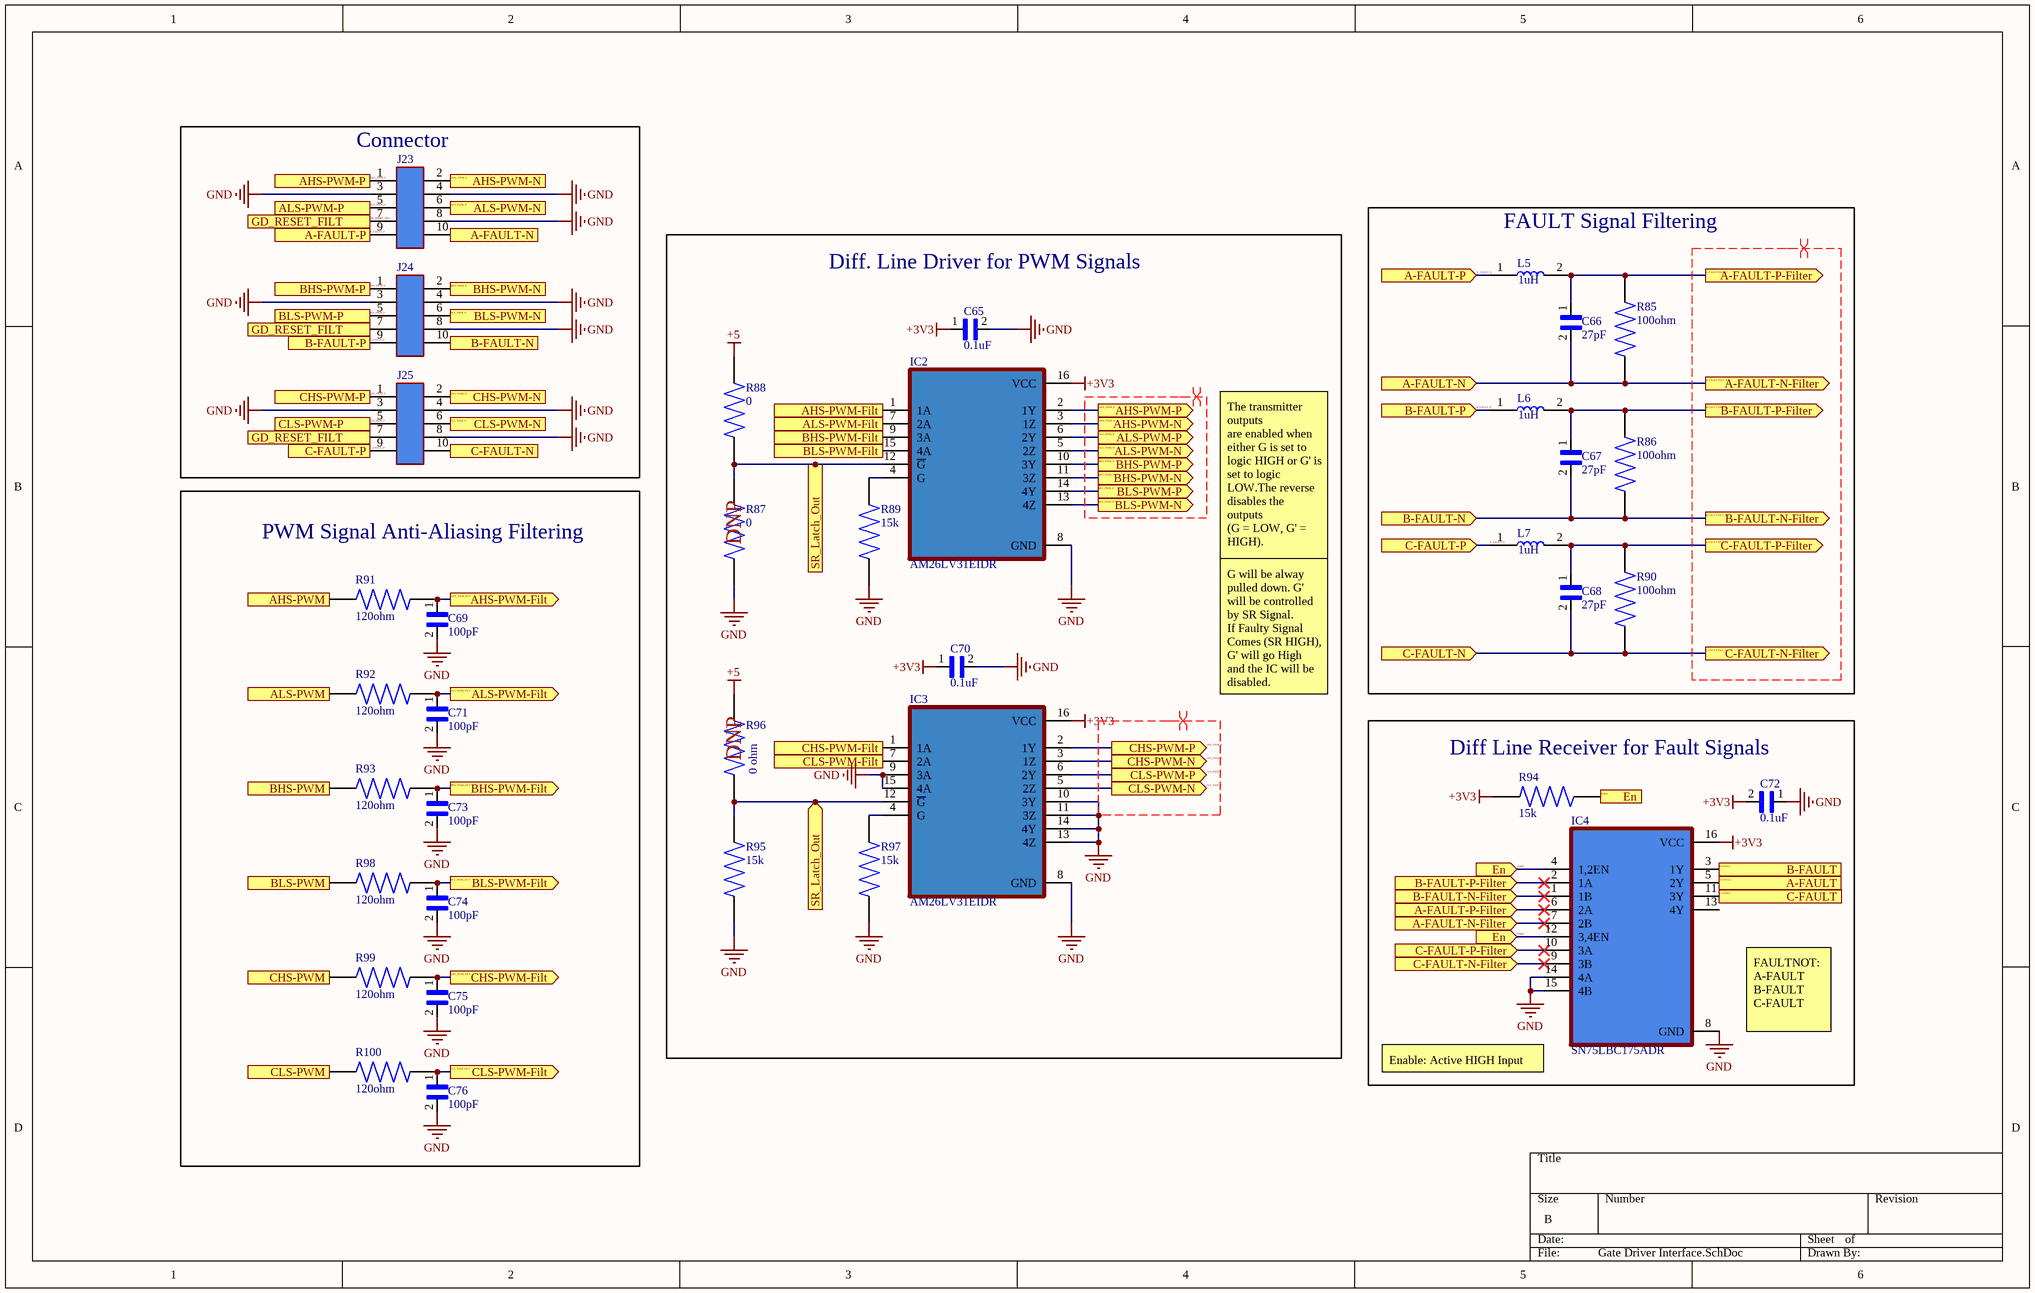
[diagram p8: Gate Driver Interface.SchDoc]

### Parts
C65  0.1uF  [CAP 0805(2012 metric)]
C66  27pF  [CAP 0805(2012 metric)]
C67  27pF  [CAP 0805(2012 metric)]
C68  27pF  [CAP 0805(2012 metric)]
C69  100pF  [CAP 0805(2012 metric)]
C70  0.1uF  [CAP 0805(2012 metric)]
C71  100pF  [CAP 0805(2012 metric)]
C72  0.1uF  [CAP 0805(2012 metric)]
C73  100pF  [CAP 0805(2012 metric)]
C74  100pF  [CAP 0805(2012 metric)]
C75  100pF  [CAP 0805(2012 metric)]
C76  100pF  [CAP 0805(2012 metric)]
IC2  AM26LV31EIDR  [SOIC127P600X175-16N]
IC3  AM26LV31EIDR  [SOIC127P600X175-16N]
IC4  SN75LBC175ADR  [SN75LBC175ADR]
J23  2ROW10POS  [2ROW10POS]  (value not drawn)
J24  2ROW10POS  [2ROW10POS]  (value not drawn)
J25  2ROW10POS  [2ROW10POS]  (value not drawn)
L5  1uH  [IND 0805]
L6  1uH  [IND 0805]
L7  1uH  [IND 0805]
R85  100ohm  [RES 0805(2012 metric)]
R86  100ohm  [RES 0805(2012 metric)]
R87  0  [RES 0805(2012 metric)]
R88  0  [RES 0805(2012 metric)]
R89  15k  [RES 0805(2012 metric)]
R90  100ohm  [RES 0805(2012 metric)]
R91  120ohm  [RES 0805(2012 metric)]
R92  120ohm  [RES 0805(2012 metric)]
R93  120ohm  [RES 0805(2012 metric)]
R94  15k  [RES 0805(2012 metric)]
R95  15k  [RES 0805(2012 metric)]
R96  0 ohm  [RES 0805(2012 metric)]
R97  15k  [RES 0805(2012 metric)]
R98  120ohm  [RES 0805(2012 metric)]
R99  120ohm  [RES 0805(2012 metric)]
R100  120ohm  [RES 0805(2012 metric)]

### Blocks framed on the sheet
Connector: J23-J25
FAULT Signal Filtering: C66-C68 L5-L7 R85 R86 R90
PWM Signal Anti-Aliasing Filtering: C69 C71 C73-C76 R91-R93 R98-R100
Diff Line Receiver for Fault Signals: C72 IC4 R94

### Ports
A-FAULT (out), A-FAULT-N (in), A-FAULT-N (out), A-FAULT-N-Filter (in), A-FAULT-N-Filter (out), A-FAULT-P (in), A-FAULT-P (out), A-FAULT-P-Filter (in), A-FAULT-P-Filter (out), AHS-PWM (in), AHS-PWM-Filt (in), AHS-PWM-Filt (out), AHS-PWM-N (in), AHS-PWM-N (out), AHS-PWM-P (in), AHS-PWM-P (out), ALS-PWM (in), ALS-PWM-Filt (in), ALS-PWM-Filt (out), ALS-PWM-N (in), ALS-PWM-N (out), ALS-PWM-P (in), ALS-PWM-P (out), B-FAULT (out), B-FAULT-N (in), B-FAULT-N (out), B-FAULT-N-Filter (in), B-FAULT-N-Filter (out), B-FAULT-P (in), B-FAULT-P (out), B-FAULT-P-Filter (in), B-FAULT-P-Filter (out), BHS-PWM (in), BHS-PWM-Filt (in), BHS-PWM-Filt (out), BHS-PWM-N (in), BHS-PWM-N (out), BHS-PWM-P (in), BHS-PWM-P (out), BLS-PWM (in), BLS-PWM-Filt (in), BLS-PWM-Filt (out), BLS-PWM-N (in), BLS-PWM-N (out), BLS-PWM-P (in), BLS-PWM-P (out), C-FAULT (out), C-FAULT-N (in), C-FAULT-N (out), C-FAULT-N-Filter (in), C-FAULT-N-Filter (out), C-FAULT-P (in), C-FAULT-P (out), C-FAULT-P-Filter (in), C-FAULT-P-Filter (out), CHS-PWM (in), CHS-PWM-Filt (in), CHS-PWM-Filt (out), CHS-PWM-N (in), CHS-PWM-N (out), CHS-PWM-P (in), CHS-PWM-P (out), CLS-PWM (in), CLS-PWM-Filt (in), CLS-PWM-Filt (out), CLS-PWM-N (in), CLS-PWM-N (out), CLS-PWM-P (in), CLS-PWM-P (out), En (in), En (out), GD_RESET_FILT (in), SR_Latch_Out (in)

### Nets
+3V3: C65.1 C70.1 C72.2 IC2.16(VCC) IC3.16(VCC) IC4.16(VCC) R94.2
+5: R88.2 R96.2
GND: C65.2 C69.2 C70.2 C71.2 C72.1 C73.2 C74.2 C75.2 C76.2 IC2.8(GND) IC3.8(GND) IC3.9(3A) IC3.10(3Y) IC3.11(3Z) IC3.13(4Z) IC3.14(4Y) IC3.15(4A) IC4.8(GND) IC4.14(4A) IC4.15(4B) J23.3 J23.4 J23.8 J24.3 J24.4 J24.8 J25.3 J25.4 J25.8 R87.1 R89.1 R95.1 R97.1
A-FAULT: IC4.5(2Y) ; port A-FAULT
A-FAULT-FILT_N: C66.2 IC4.7(2B) J23.10 R85.1 ; port A-FAULT-N, port A-FAULT-N-Filter
A-FAULT-FILT_P: C66.1 IC4.6(2A) L5.2 R85.2 ; port A-FAULT-P-Filter
A_FAULT_P: J23.9 L5.1 ; port A-FAULT-P
AHS-PWM: R91.1 ; port AHS-PWM
AHS_PWM_FILT: C69.1 IC2.1(1A) R91.2 ; port AHS-PWM-Filt
AHS_PWM_N: IC2.3(1Z) J23.2 ; port AHS-PWM-N
AHS_PWM_P: IC2.2(1Y) J23.1 ; port AHS-PWM-P
ALS-PWM: R92.1 ; port ALS-PWM
ALS_PWM_FILT: C71.1 IC2.7(2A) R92.2 ; port ALS-PWM-Filt
ALS_PWM_N: IC2.5(2Z) J23.6 ; port ALS-PWM-N
ALS_PWM_P: IC2.6(2Y) J23.5 ; port ALS-PWM-P
B-FAULT: IC4.3(1Y) ; port B-FAULT
B-FAULT-FILT_N: C67.2 IC4.1(1B) J24.10 R86.1 ; port B-FAULT-N, port B-FAULT-N-Filter
B-FAULT-FILT_P: C67.1 IC4.2(1A) L6.2 R86.2 ; port B-FAULT-P-Filter
B_FAULT_P: J24.9 L6.1 ; port B-FAULT-P
BHS-PWM: R93.1 ; port BHS-PWM
BHS_PWM_FILT: C73.1 IC2.9(3A) R93.2 ; port BHS-PWM-Filt
BHS_PWM_N: IC2.11(3Z) J24.2 ; port BHS-PWM-N
BHS_PWM_P: IC2.10(3Y) J24.1 ; port BHS-PWM-P
BLS-PWM: R98.1 ; port BLS-PWM
BLS_PWM_FILT: C74.1 IC2.15(4A) R98.2 ; port BLS-PWM-Filt
BLS_PWM_N: IC2.13(4Z) J24.6 ; port BLS-PWM-N
BLS_PWM_P: IC2.14(4Y) J24.5 ; port BLS-PWM-P
C-FAULT: IC4.11(3Y) ; port C-FAULT
C-FAULT-FILT_N: C68.2 IC4.9(3B) J25.10 R90.1 ; port C-FAULT-N, port C-FAULT-N-Filter
C-FAULT-FILT_P: C68.1 IC4.10(3A) L7.2 R90.2 ; port C-FAULT-P-Filter
C_FAULT_P: J25.9 L7.1 ; port C-FAULT-P
CHS-PWM: R99.1 ; port CHS-PWM
CHS_PWM_FILT: C75.1 IC3.1(1A) R99.2 ; port CHS-PWM-Filt
CHS_PWM_N: IC3.3(1Z) J25.2 ; port CHS-PWM-N
CHS_PWM_P: IC3.2(1Y) J25.1 ; port CHS-PWM-P
CLS-PWM: R100.1 ; port CLS-PWM
CLS_PWM_FILT: C76.1 IC3.7(2A) R100.2 ; port CLS-PWM-Filt
CLS_PWM_N: IC3.5(2Z) J25.6 ; port CLS-PWM-N
CLS_PWM_P: IC3.6(2Y) J25.5 ; port CLS-PWM-P
enable: IC4.4(1,2EN) IC4.12(3,4EN) R94.1 ; port En
GD_RESET_FILT: J23.7 J24.7 J25.7 ; port GD_RESET_FILT
SR_Latch_out: IC2.12(~{G}) IC3.12(~{G}) R87.2 R88.1 R95.2 R96.1 ; port SR_Latch_Out
NetIC2_4: IC2.4(G) R89.2
NetIC3_4: IC3.4(G) R97.2

Not connected (* = marked no-connect by the designer): IC4 13(4Y)

### Layout directives
differential pair; differential pair class DIFF90: A-FAULT-FILT_N, A-FAULT-FILT_P, AHS_PWM_N, AHS_PWM_P, ALS_PWM_N, ALS_PWM_P, B-FAULT-FILT_N, B-FAULT-FILT_P, BHS_PWM_N, BHS_PWM_P, BLS_PWM_N, BLS_PWM_P, C-FAULT-FILT_N, C-FAULT-FILT_P, CHS_PWM_N, CHS_PWM_P, CLS_PWM_N, CLS_PWM_P

### Notes on the sheet
- Diff. Line Driver for PWM Signals
- (near R87) DNP
- The transmitter outputs
  are enabled when either G is set to logic HIGH or G' is set to logic LOW.The reverse disables the outputs
  (G = LOW, G' = HIGH).
- G will be alway pulled down. G' will be controlled by SR Signal.
  If Faulty Signal Comes (SR HIGH), G' will go High and the IC will be disabled.
- (near R96) DNP
- FAULTNOT:  A-FAULT B-FAULT C-FAULT
- (near IC4) Enable: Active HIGH Input

### Library data of the parts
C65 C70 C72 = 0.1uF 25V 0805: as C28 on sheet Launchpad.~(23)
C66-C68 = 27pF 50V: CL10 Series 27 pF 50 V ±5 % Tolerance
C69 C71 C73-C76 = 100pF 50V: 100pF ±5% 50V Ceramic Capacitor C0G, NP0 0805 (2012 Metric)
L5-L7 = 1uH 0805: as L8 on sheet PowerSupply
R85 R86 R90 = 100ohm 0.1W: as R61 on sheet Resolver
R87-R89 R94 R95 R97 = 15k 0805: 15k 0805 0.1W
R91-R93 R98-R100 = 120ohm 0805: as R45 on sheet Launchpad.~(23)
R96 = 0ohm 0805: 0 ohm 0805 res

## Sheet Block Diagram.SchDoc
size B
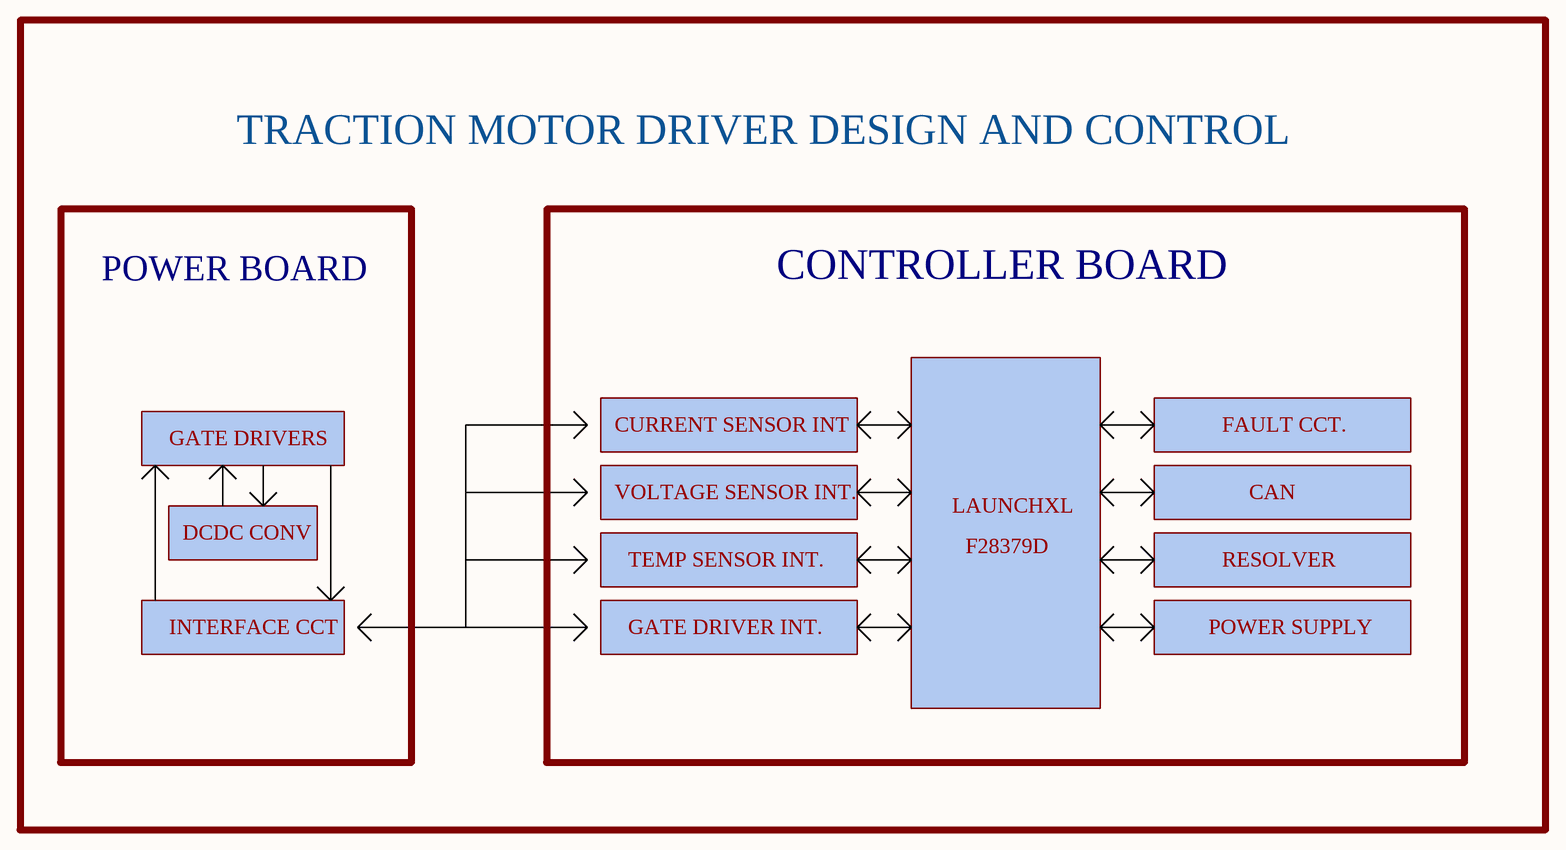
[diagram p9: Block Diagram.SchDoc]

### Notes on the sheet
- TRACTION MOTOR DRIVER DESIGN AND CONTROL
- POWER BOARD
- CONTROLLER BOARD
- GATE DRIVERS
- CURRENT SENSOR INT
- FAULT CCT.
- DCDC CONV
- VOLTAGE SENSOR INT.
- LAUNCHXL
- CAN
- TEMP SENSOR INT.
- F28379D
- RESOLVER
- INTERFACE CCT
- GATE DRIVER INT.
- POWER SUPPLY

## Nets that join several sheets
+3V3: Launchpad.~(23) (10 pins), PowerSupply (6 pins), CAN (C24.1 IC1.3 IC1.5 R30.2), Resolver (L4.1), Gate Driver Interface (7 pins)
+3V3VA: FaultCircuit (C10.1 R13.2 U3.5), PowerSupply (C29.2 L9.1)
+5: Current Sensor Interface (J1.2), Launchpad.~(23) (6 pins), PowerSupply (8 pins), Temp Sensor Interface (5 pins), Gate Driver Interface (R88.2 R96.2)
+5VA: FaultCircuit (13 pins), PowerSupply (C23.2 L8.1)
+12: PowerSupply (6 pins), Resolver (L2.1)
GND: Current Sensor Interface (15 pins), FaultCircuit (27 pins), Launchpad.~(23) (29 pins), PowerSupply (19 pins), CAN (8 pins), Voltage Sensor Interface (C25.2 C26.2 C27.2), Temp Sensor Interface (15 pins), Resolver (27 pins), Gate Driver Interface (33 pins)
A-FAULT: Launchpad.~(23) (J11.8 R48.1 U5.12), Gate Driver Interface (IC4.5)
AHS-PWM: Launchpad.~(23) (J8.1), Voltage Sensor Interface (R28#2.1), Gate Driver Interface (R91.1)
ALS-PWM: Launchpad.~(23) (J8.2), Gate Driver Interface (R92.1)
B-FAULT: Launchpad.~(23) (J11.9 R49.1 U5.10), Gate Driver Interface (IC4.3)
BHS-PWM: Launchpad.~(23) (J8.3), Voltage Sensor Interface (R27#2.1), Gate Driver Interface (R93.1)
BLS-PWM: Launchpad.~(23) (J8.4), Gate Driver Interface (R98.1)
C-FAULT: Launchpad.~(23) (J11.10 R50.1 U5.9), Gate Driver Interface (IC4.11)
CANA-RX: Launchpad.~(23) (J6.4), CAN (IC1.4)
CANA-TX: Launchpad.~(23) (J6.3), CAN (IC1.1)
CHS-PWM: Launchpad.~(23) (J8.5), Voltage Sensor Interface (R26#2.1), Gate Driver Interface (R99.1)
CLS-PWM: Launchpad.~(23) (J8.6), Gate Driver Interface (R100.1)
CPU_RES_COS: Launchpad.~(23) (J14.8), Resolver (7.1 C50#2.1 R66#2.2)
CPU_RES_REF: Launchpad.~(23) (J7.10), Resolver (9.1 R78.1)
CPU_RES_SIN: Launchpad.~(23) (J14.9), Resolver (6.1 C47#2.1 R65#2.2)
CPU_TEMP_BUSBAR: Launchpad.~(23) (J14.5), Temp Sensor Interface (C47#1.1 R65#1.2)
CPU_TEMP_BUSCAP: Launchpad.~(23) (J14.3), Temp Sensor Interface (C51#1.1 R69#1.2)
CPU_TEMP_IGBT1: Launchpad.~(23) (J14.4), Temp Sensor Interface (C46#1.1 R64#1.2)
CPU_TEMP_IGBT2: Launchpad.~(23) (J14.6), Temp Sensor Interface (C50#1.1 R68#1.2)
CPU_TEMP_IGBT3: Launchpad.~(23) (J14.7), Temp Sensor Interface (C53#1.1 R71#1.2)
Current-A: Current Sensor Interface (C4.1 R4.2 R7.2), Launchpad.~(23) (J7.6)
Current-B: Current Sensor Interface (C5.1 R5.2 R8.2), Launchpad.~(23) (J7.7)
Current-C: Current Sensor Interface (C6.1 R6.2 R9.2), Launchpad.~(23) (J7.8)
CVSense_Fault: FaultCircuit (10 pins), Launchpad.~(23) (J11.7 R44.1 U5.13)
GD_RESET_FILT: Launchpad.~(23) (C28.1 R37.2), Gate Driver Interface (J23.7 J24.7 J25.7)
IA_Filtered: Current Sensor Interface (C1.1 R1.2), FaultCircuit (R11.2 R14.2 U1.5 U1.6)
IB_Filtered: Current Sensor Interface (C2.1 R2.2), FaultCircuit (R12.1 R15.1 U1.9 U1.10)
IC_Filtered: Current Sensor Interface (C3.1 R3.2), FaultCircuit (R16.2 R17.2 U2.5 U2.6)
SR-RESET: FaultCircuit (U4.3), Launchpad.~(23) (J8.7)
SR_Latch_out: FaultCircuit (U4.2), Gate Driver Interface (6 pins)
UART_RX: Launchpad.~(23) (J13.3), CAN (J5.1)
UART_TX: Launchpad.~(23) (J13.4), CAN (J5.2)
VBUS_FILTERED: Current Sensor Interface (C7.1 R10.2), FaultCircuit (R18.1 R19.1 U2.9 U2.10)
VOLTAGE-A: Launchpad.~(23) (J7.3), Voltage Sensor Interface (C27.1 R28#2.2)
VOLTAGE-B: Launchpad.~(23) (J7.4), Voltage Sensor Interface (C26.1 R27#2.2)
VOLTAGE-C: Launchpad.~(23) (J7.5), Voltage Sensor Interface (C25.1 R26#2.2)